# Altium project MainBoard.PrjPCB (part 1 of 2)
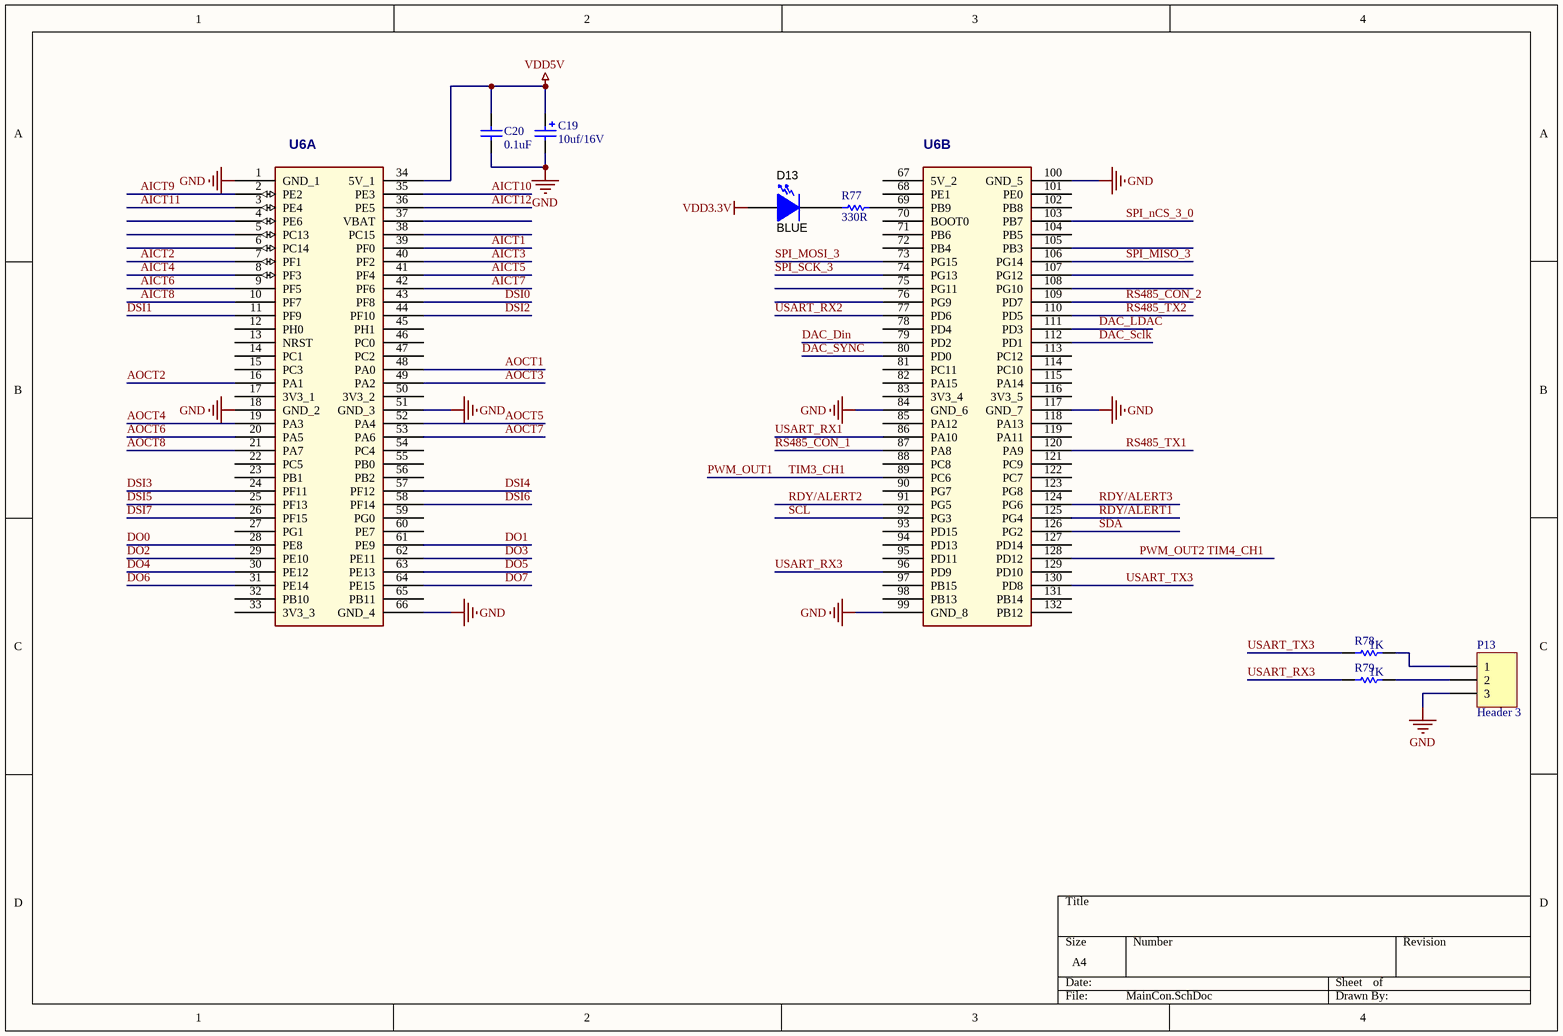
[diagram p0: MainCon.SchDoc]
9 sheets, 474 parts. Net scope: global (net labels, ports and power ports of the same name join across sheets).
Board file: MainBoard.PcbDoc
Sheets:
  MainCon.SchDoc
  MainPower.SchDoc
  MainDAC.SchDoc
  MainADC.SchDoc
  MainMux.SchDoc
  MainRTD.SchDoc
  Main485.SchDoc
  MainDin.SchDoc
  MainDout.SchDoc

## Sheet MainCon.SchDoc
size A4

### Parts
C19  value 10uf/16V  [Cap-A]
C20  value 0.1uF  [C0805]  (hidden comment: Cap)
D13  value BLUE  [D0805]  (hidden comment: SML-P12YTT86)
P13  Header 3  [HDR1X3]
R77  value 330R  [0805]  (hidden comment: Res Semi)
R78  value 1K  [0805]  (hidden comment: Res1)
R79  value 1K  [0805]  (hidden comment: Res1)
U6  STM32Z_MOD  [STM32VEMOD]  (value not drawn)  (parts A,B of 2)

### Nets
GND: C19.2 C20.1 P13.3 U6.1(GND_1) U6.18(GND_2) U6.51(GND_3) U6.66(GND_4) U6.84(GND_6) U6.99(GND_8) U6.100(GND_5) U6.117(GND_7)
VDD3.3V: D13.1(A)
VDD5V: C19.1 C20.2 U6.34(5V_1)
AICT1: U6.39(PF0)
AICT2: U6.7(PF1)
AICT3: U6.40(PF2)
AICT4: U6.8(PF3)
AICT5: U6.41(PF4)
AICT6: U6.9(PF5)
AICT7: U6.42(PF6)
AICT8: U6.10(PF7)
AICT9: U6.2(PE2)
AICT10: U6.35(PE3)
AICT11: U6.3(PE4)
AICT12: U6.36(PE5)
AOCT1: U6.48(PA0)
AOCT2: U6.16(PA1)
AOCT3: U6.49(PA2)
AOCT4: U6.19(PA3)
AOCT5: U6.52(PA4)
AOCT6: U6.20(PA5)
AOCT7: U6.53(PA6)
AOCT8: U6.21(PA7)
DAC_Din: U6.79(PD2)
DAC_LDAC: U6.111(PD3)
DAC_Sclk: U6.112(PD1)
DAC_SYNC: U6.80(PD0)
DO0: U6.28(PE8)
DO1: U6.61(PE9)
DO2: U6.29(PE10)
DO3: U6.62(PE11)
DO4: U6.30(PE12)
DO5: U6.63(PE13)
DO6: U6.31(PE14)
DO7: U6.64(PE15)
DSI0: U6.43(PF8)
DSI1: U6.11(PF9)
DSI2: U6.44(PF10)
DSI3: U6.24(PF11)
DSI4: U6.57(PF12)
DSI5: U6.25(PF13)
DSI6: U6.58(PF14)
DSI7: U6.26(PF15)
PWM_OUT1: U6.89(PC6)  [also labelled TIM3_CH1]
PWM_OUT2: U6.128(PD12)  [also labelled TIM4_CH1]
RDY/ALERT1: U6.125(PG4)
RDY/ALERT2: U6.91(PG5)
RDY/ALERT3: U6.124(PG6)
RS485_CON_1: U6.87(PA8)
RS485_CON_2: U6.109(PD7)
RS485_TX1: U6.120(PA9)
RS485_TX2: U6.110(PD5)
SCL: U6.92(PG3)
SDA: U6.126(PG2)
SPI_MISO_3: U6.106(PG14)
SPI_MOSI_3: U6.73(PG15)
SPI_nCS_3_0: U6.103(PB7)
SPI_SCK_3: U6.74(PG13)
USART_RX1: U6.86(PA10)
USART_RX2: U6.77(PD6)
USART_RX3: R79.1 U6.96(PD9)
USART_TX3: R78.1 U6.130(PD8)
NetD13_2: D13.2(K) R77.2
NetP13_1: P13.1 R78.2
NetP13_2: P13.2 R79.2
NetR77_1: R77.1 U6.69(PB9)

Not connected (* = marked no-connect by the designer): U6 4(PE6) 5(PC13) 6(PC14) 12(PH0) 13(NRST) 14(PC1) 15(PC3) 17(3V3_1) 22(PC5) 23(PB1) 27(PG1) 32(PB10) 33(3V3_3) 37(VBAT) 38(PC15) 45(PH1) 46(PC0) 47(PC2) 50(3V3_2) 54(PC4) 55(PB0) 56(PB2) 59(PG0) 60(PE7) 65(PB11) 67(5V_2) 68(PE1) 70(BOOT0) 71(PB6) 72(PB4) 75(PG11) 76(PG9) 78(PD4) 81(PC11) 82(PA15) 83(3V3_4) 85(PA12) 88(PC8) 90(PG7) 93(PD15) 94(PD13) 95(PD11) 97(PB15) 98(PB13) 101(PE0) 102(PB8) 104(PB5) 105(PB3) 107(PG12) 108(PG10) 113(PC12) 114(PC10) 115(PA14) 116(3V3_5) 118(PA13) 119(PA11) 121(PC9) 122(PC7) 123(PG8) 127(PD14) 129(PD10) 131(PB14) 132(PB12)

### Library data of the parts
C19 = Cap Pol2: Polarized Capacitor (Axial); Published: 8-Jun-2000; LatestRevisionDate: 17-Jul-2002; LatestRevisionNote: Re-released for DXP Platform.; PackageReference: POLAR0.8; Publisher: Altium Limited; PackageDescription: Polarized Capacitor; 2 Leads
C20 = Cap_2: Capacitor; Published: 8-Jun-2000; LatestRevisionDate: 17-Jul-2002; LatestRevisionNote: Re-released for DXP Platform.; Publisher: Altium Limited
D13 = SML-P12YTT86: LED, GREEN SMD; Manufacturer: Rohm; Type: InGaN; Vf_V: 2.1; Value2: 2.1V; Io_A: 0.02; Tjmax_C: 85; Value1: W; Color: yellow; U/M: EA; CompType: LED; PartNumber: SML-P12YTT86; SymbolVersion: 2008-12-08; MountType: SMT; RoHS: Y; PackageReference: Yellow LED; Published: 2008-07-11; Publisher: Texas Instruments; ComponentLink1URL: http://rohmfs.rohm.com/en/products/databook/datasheet/opto/led/chip_mono/sml-p1.pdf; ComponentLink1Description: Datasheet link; LatestRevisionDate: 2013-06-24; LatestRevisionNote: Updated supplier queries; Supplier 1: Digi-Key; Supplier Part Number 1: 511-1595-1-ND; Supplier 2: Mouser; Supplier Part Number 2: 755-SML-P12YTT86; Supplier 3: Farnell; Supplier Part Number 3: 1973107
P13 = Header 3: Header, 3-Pin; LatestRevisionDate: 17-Jul-2002; LatestRevisionNote: Re-released for DXP Platform.; Publisher: Altium Limited
R77 = Res Semi: Semiconductor Resistor; Published: 8-Jun-2000; LatestRevisionDate: 17-Jul-2002; LatestRevisionNote: Re-released for DXP Platform.; PackageReference: AXIAL-0.5; Publisher: Altium Limited
R78 R79 = Res1: Resistor; Published: 8-Jun-2000; LatestRevisionDate: 17-Jul-2002; LatestRevisionNote: Re-released for DXP Platform.; PackageReference: AXIAL-0.3; Publisher: Altium Limited
U6 = STM32Z_MOD: PCB Footprint SMD: 插件; TOLERANCE: =U5_TOLERANCE; Technology: 2mm，2X33插座

## Sheet MainPower.SchDoc
size A4
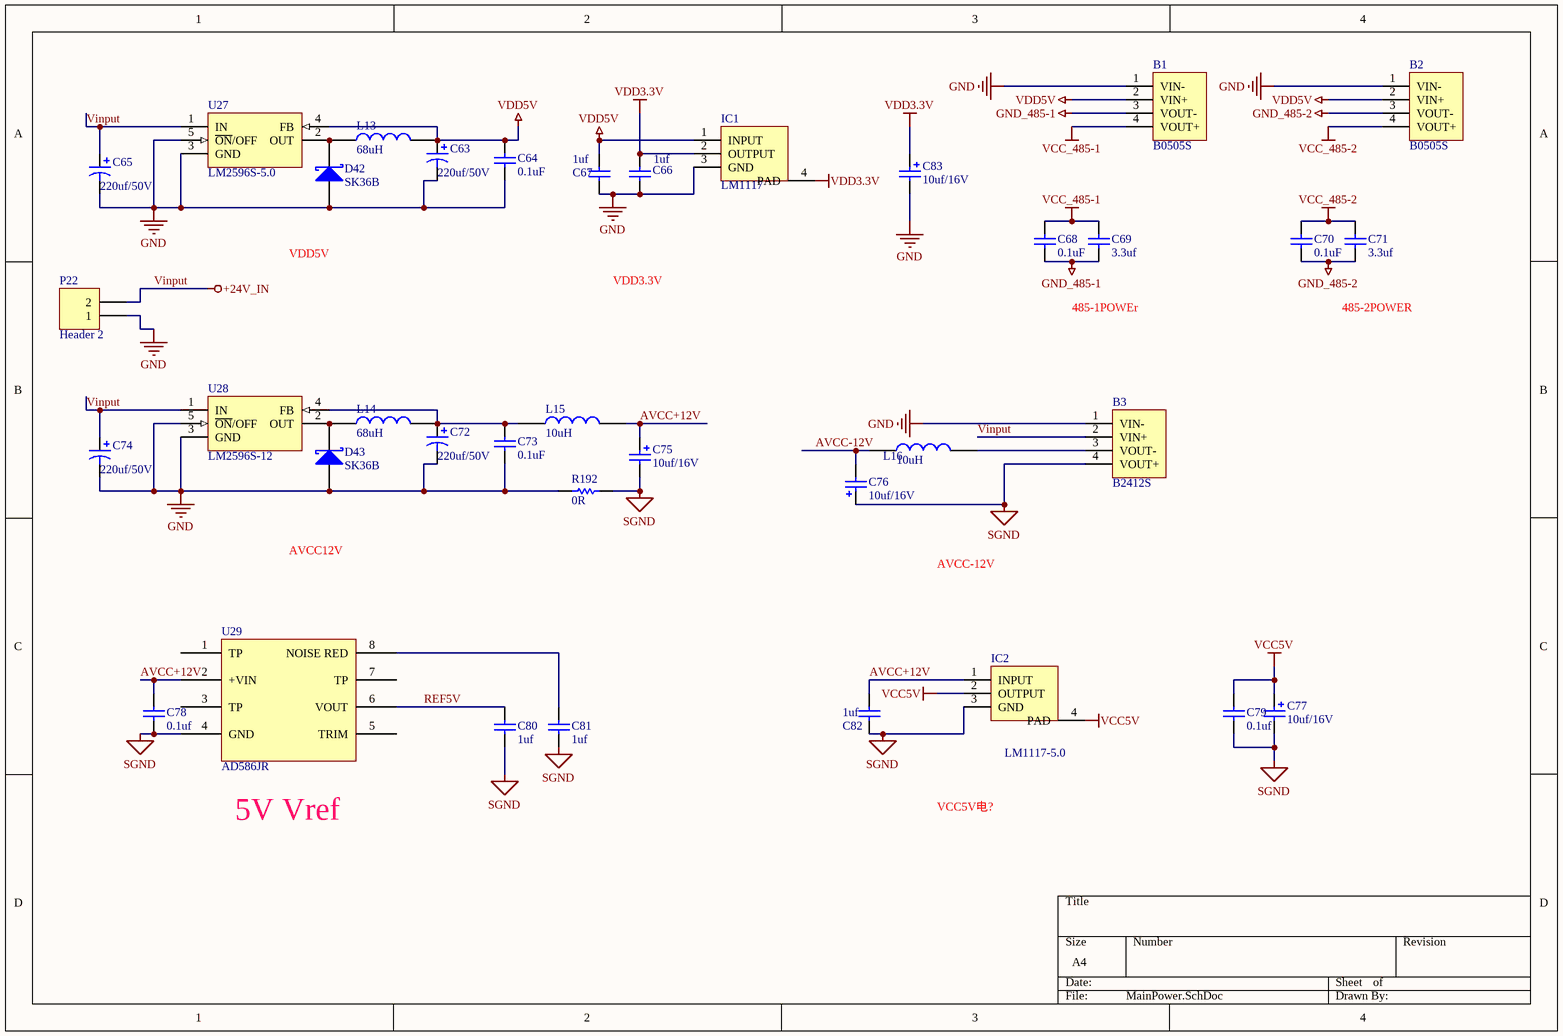
[diagram p1: MainPower.SchDoc]

### Parts
B1  B0505S  [B0505S]
B2  B0505S  [B0505S]
B3  B2412S  [B0505S]
C63  value 220uf/50V  [Cap5*10*12]  (hidden comment: Cap Pol1)
C64  value 0.1uF  [C0805]  (hidden comment: Cap)
C65  value 220uf/50V  [Cap5*10*12]  (hidden comment: Cap Pol1)
C66  value 1uf  [C0805]  (hidden comment: Cap)
C67  value 1uf  [C0805]  (hidden comment: Cap)
C68  value 0.1uF  [C0805]  (hidden comment: Cap)
C69  value 3.3uf  [C0805]  (hidden comment: Cap)
C70  value 0.1uF  [C0805]  (hidden comment: Cap)
C71  value 3.3uf  [C0805]  (hidden comment: Cap)
C72  value 220uf/50V  [Cap5*10*12]  (hidden comment: Cap Pol1)
C73  value 0.1uF  [C0805]  (hidden comment: Cap)
C74  value 220uf/50V  [Cap5*10*12]  (hidden comment: Cap Pol1)
C75  value 10uf/16V  [Cap-A]
C76  value 10uf/16V  [Cap-A]
C77  value 10uf/16V  [Cap-A]
C78  value 0.1uf  [C0805]  (hidden comment: Cap)
C79  value 0.1uf  [C0805]  (hidden comment: Cap)
C80  value 1uf  [C0805]  (hidden comment: Cap)
C81  value 1uf  [C0805]  (hidden comment: Cap)
C82  value 1uf  [C0805]  (hidden comment: Cap)
C83  value 10uf/16V  [Cap-A]
D42  SK36B  [SMB]
D43  SK36B  [SMB]
IC1  LM1117  [LM1117]
IC2  LM1117-5.0  [LM1117]
L13  68uH  [IND_HM00_12*12]
L14  68uH  [IND_HM00_12*12]
L15  10uH  [L1206]
L16  10uH  [L1206]
P22  Header 2  [JIEKE_2PX508]
R192  value 0R  [0805]  (hidden comment: Res Semi)
U27  LM2596S-5.0  [TS5B_M]
U28  LM2596S-12  [TS5B_M]
U29  AD586JR  [SOP8_M]

### Nets
GND: B1.1(VIN-) B2.1(VIN-) B3.1(VIN-) C63.2 C64.1 C65.2 C66.2 C67.2 C72.2 C73.1 C74.2 C83.2 D42.1(A) D43.1(A) IC1.3(GND) P22.1 R192.2 U27.3(GND) U27.5(~{ON}/OFF) U28.3(GND) U28.5(~{ON}/OFF)
GND_485-1: B1.3(VOUT-) C68.1 C69.1
GND_485-2: B2.3(VOUT-) C70.1 C71.1
SGND: B3.4(VOUT+) C75.2 C76.1 C77.2 C78.2 C79.2 C80.2 C81.2 C82.2 IC2.3(GND) R192.1 U29.4(GND)
VCC5V: C77.1 C79.1 IC2.2(OUTPUT) IC2.4(PAD)
VCC_485-1: B1.4(VOUT+) C68.2 C69.2
VCC_485-2: B2.4(VOUT+) C70.2 C71.2
VDD3.3V: C66.1 C83.1 IC1.2(OUTPUT) IC1.4(PAD)
VDD5V: B1.2(VIN+) B2.2(VIN+) C63.1 C64.2 C67.1 IC1.1(INPUT) L13.2 U27.4(FB)
Vinput: B3.2(VIN+) C65.1 C74.1 P22.2 U27.1(IN) U28.1(IN)  [also labelled +24V_IN]
AVCC+12V: C75.1 C78.1 C82.1 IC2.1(INPUT) L15.2 U29.2(+VIN)
AVCC-12V: C76.2 L16.1
REF5V: C80.1 U29.6(VOUT)
NetB3_3: B3.3(VOUT-) L16.2
NetC72_1: C72.1 C73.2 L14.2 L15.1 U28.4(FB)
NetC81_1: C81.1 U29.8(NOISE_RED)
NetD42_2: D42.2(K) L13.1 U27.2(OUT)
NetD43_2: D43.2(K) L14.1 U28.2(OUT)

Not connected (* = marked no-connect by the designer): U29 1(TP) 3(TP) 5(TRIM) 7(TP)

### Notes on the sheet
- VDD5V
- VDD3.3V
- 485-1POWEr
- 485-2POWER
- AVCC12V
- AVCC-12V
- 5V Vref
- VCC5V电?

### Library data of the parts
B3 = B0505S
C63 C65 C72 C74 = Cap Pol1: Polarized Capacitor (Radial); Published: 8-Jun-2000; LatestRevisionDate: 17-Jul-2002; LatestRevisionNote: Re-released for DXP Platform.; PackageReference: RB7.6-15; Publisher: Altium Limited
C64 C68-C71 C73 = Cap_2: Capacitor; Published: 8-Jun-2000; LatestRevisionDate: 17-Jul-2002; LatestRevisionNote: Re-released for DXP Platform.; Publisher: Altium Limited
C66 C67 C78-C82 = Cap: Capacitor; Manufacturer: Generic Components; Class: Passive; Published: 08/06/2000; Publisher: Altium Hobart Technology Centre; SubClass: Capacitor
C75-C77 C83 = Cap Pol2: Polarized Capacitor (Axial); Published: 8-Jun-2000; LatestRevisionDate: 17-Jul-2002; LatestRevisionNote: Re-released for DXP Platform.; PackageReference: POLAR0.8; Publisher: Altium Limited; PackageDescription: Polarized Capacitor; 2 Leads
D42 D43 = D Schottky: Schottky Diode; Published: 8-Jun-2000; LatestRevisionDate: 17-Jul-2002; LatestRevisionNote: Re-released for DXP Platform.; PackageReference: SMB; Publisher: Altium Limited; Code_JEDEC: DO-214-AA
IC2 = LM1117
L13-L16 = INDUCTOR
P22 = Header 2: Header, 2-Pin; LatestRevisionDate: 17-Jul-2002; LatestRevisionNote: Re-released for DXP Platform.; Publisher: Altium Limited
R192 = Res Semi: Semiconductor Resistor; Published: 8-Jun-2000; LatestRevisionDate: 17-Jul-2002; LatestRevisionNote: Re-released for DXP Platform.; PackageReference: AXIAL-0.5; Publisher: Altium Limited
U27 = LM2596S-5.0: Simple Switcher Power Converter 150 kHz 3A Step Down Voltage Regulator; Note: Tab is connected to GND; Published: 15-Apr-2002; DatasheetVersion: Dec-1997; PackageReference: TS5B; Publisher: Altium Limited; PackageDescription: D2-PAK; 5 Leads; Body 14.4 (inc. leads) x 10.4 mm (LxW max); ComponentLink1Description: Manufacturer Link; ComponentLink1URL: http://www.national.com/; ComponentLink2Description: Datasheet; ComponentLink2URL: http://www.national.com/ds.cgi/LM/LM2596.pdf; ComponentLink3Description: URL Link1; ComponentLink3URL: http://www.national.com/pf/LM/LM2596.html
U28 = LM2596S-12: Simple Switcher Power Converter 150 kHz 3A Step Down Voltage Regulator; Note: Tab is connected to GND; Published: 15-Apr-2002; DatasheetVersion: Dec-1997; PackageReference: TS5B; Publisher: Altium Limited; PackageDescription: D2-PAK; 5 Leads; Body 14.4 (inc. leads) x 10.4 mm (LxW max); ComponentLink1Description: Manufacturer Link; ComponentLink1URL: http://www.national.com/; ComponentLink2Description: Datasheet; ComponentLink2URL: http://www.national.com/ds.cgi/LM/LM2596.pdf; ComponentLink3Description: URL Link1; ComponentLink3URL: http://www.national.com/pf/LM/LM2596.html
U29 = AD586L

## Sheet MainDAC.SchDoc
size A2
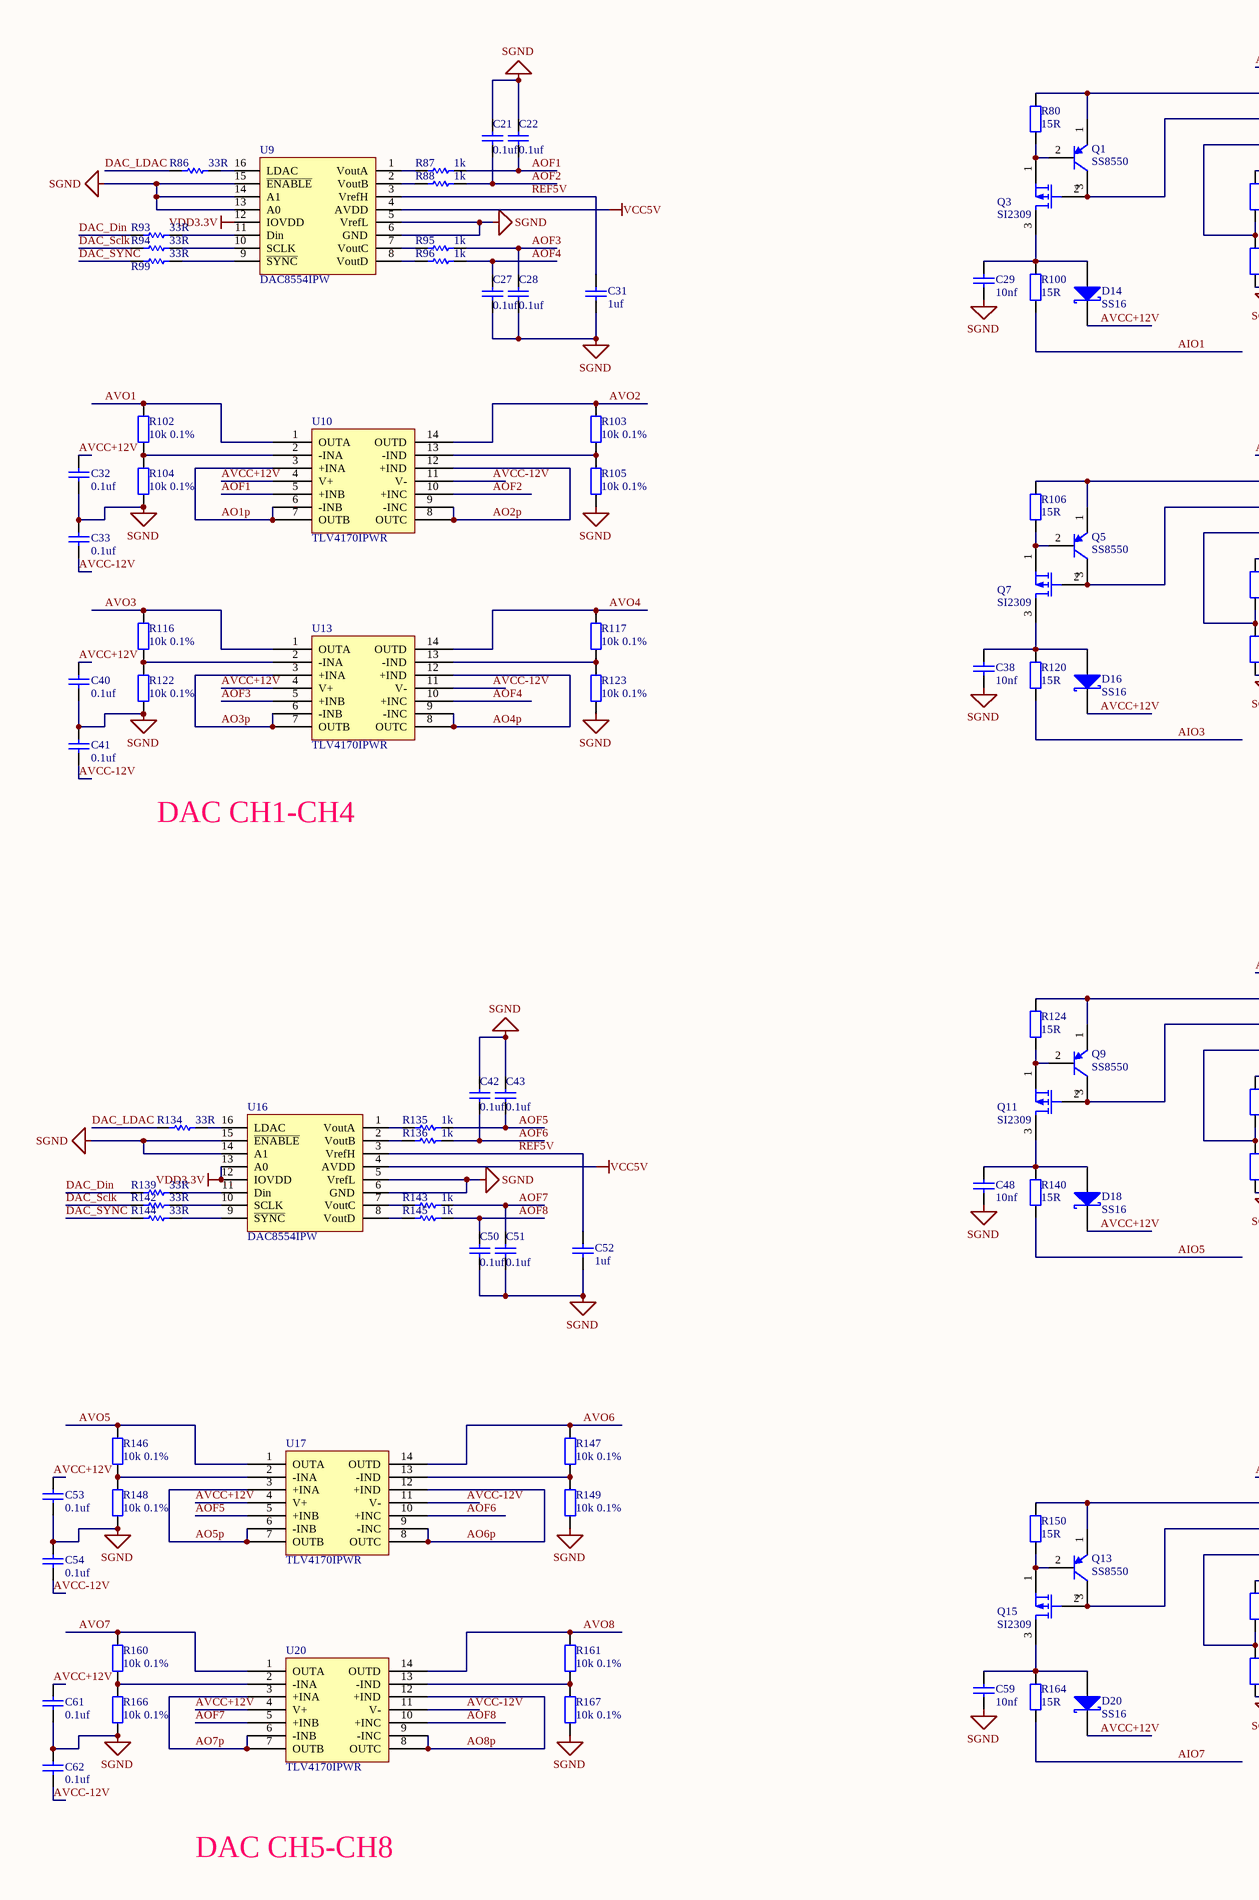
[diagram p2: MainDAC.SchDoc, left]
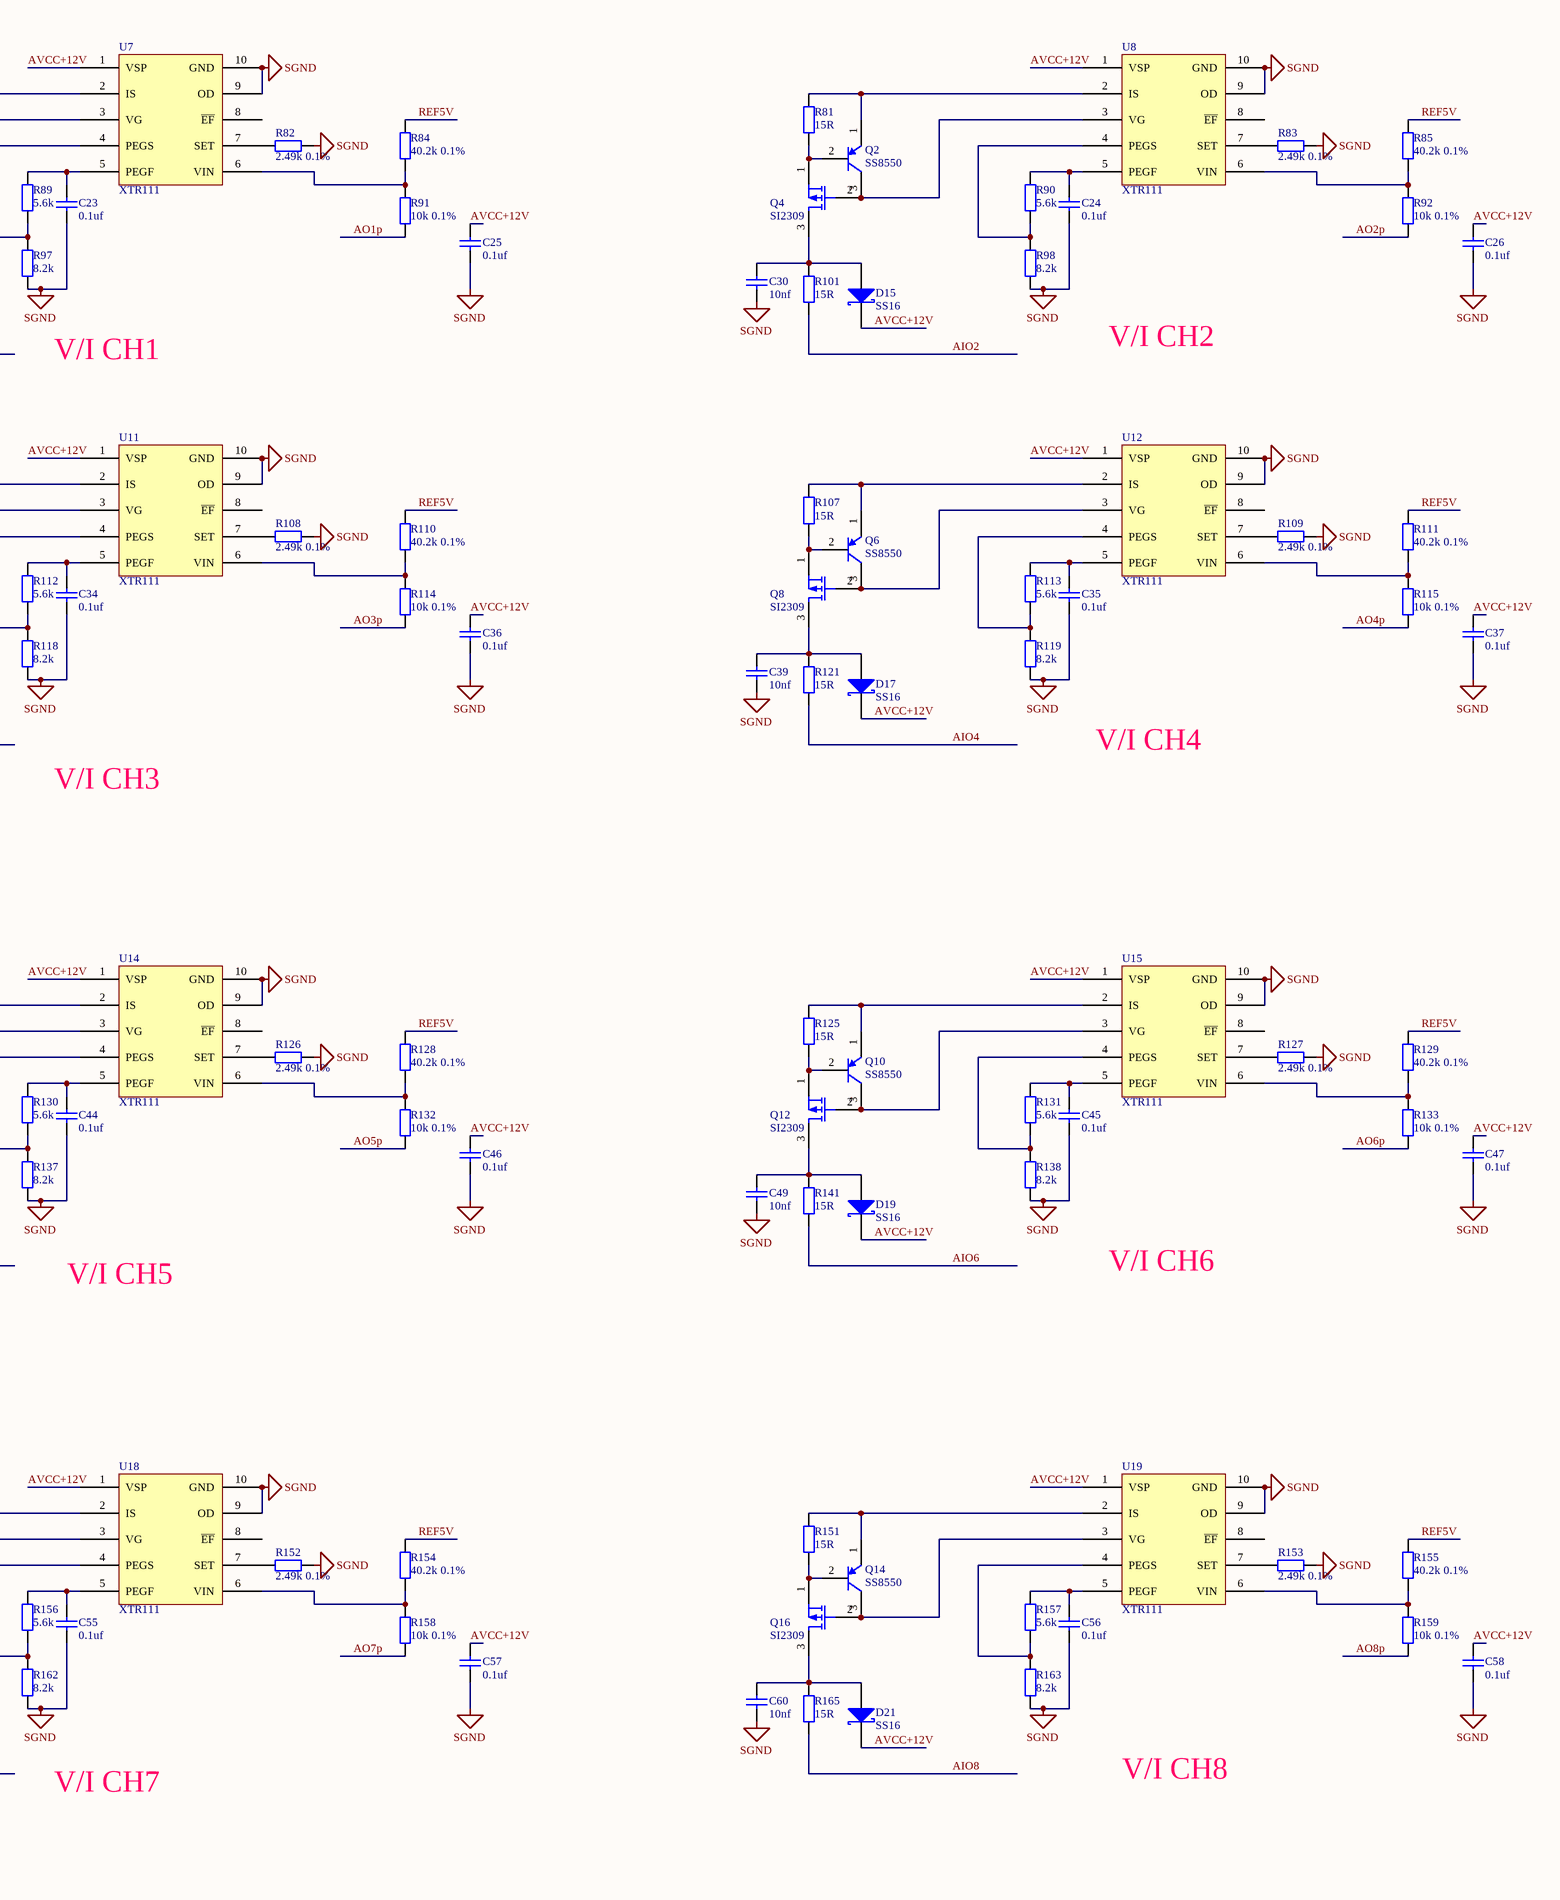
[diagram p3: MainDAC.SchDoc, right]

### Parts
C21  value 0.1uf  [C0805]  (hidden comment: Cap)
C22  value 0.1uf  [C0805]  (hidden comment: Cap)
C23  value 0.1uf  [C0805]  (hidden comment: Cap)
C24  value 0.1uf  [C0805]  (hidden comment: Cap)
C25  value 0.1uf  [C0805]  (hidden comment: Cap)
C26  value 0.1uf  [C0805]  (hidden comment: Cap)
C27  value 0.1uf  [C0805]  (hidden comment: Cap)
C28  value 0.1uf  [C0805]  (hidden comment: Cap)
C29  value 10nf  [C0805]  (hidden comment: Cap)
C30  value 10nf  [C0805]  (hidden comment: Cap)
C31  value 1uf  [C0805]  (hidden comment: Cap)
C32  value 0.1uf  [C0805]  (hidden comment: Cap)
C33  value 0.1uf  [C0805]  (hidden comment: Cap)
C34  value 0.1uf  [C0805]  (hidden comment: Cap)
C35  value 0.1uf  [C0805]  (hidden comment: Cap)
C36  value 0.1uf  [C0805]  (hidden comment: Cap)
C37  value 0.1uf  [C0805]  (hidden comment: Cap)
C38  value 10nf  [C0805]  (hidden comment: Cap)
C39  value 10nf  [C0805]  (hidden comment: Cap)
C40  value 0.1uf  [C0805]  (hidden comment: Cap)
C41  value 0.1uf  [C0805]  (hidden comment: Cap)
C42  value 0.1uf  [C0805]  (hidden comment: Cap)
C43  value 0.1uf  [C0805]  (hidden comment: Cap)
C44  value 0.1uf  [C0805]  (hidden comment: Cap)
C45  value 0.1uf  [C0805]  (hidden comment: Cap)
C46  value 0.1uf  [C0805]  (hidden comment: Cap)
C47  value 0.1uf  [C0805]  (hidden comment: Cap)
C48  value 10nf  [C0805]  (hidden comment: Cap)
C49  value 10nf  [C0805]  (hidden comment: Cap)
C50  value 0.1uf  [C0805]  (hidden comment: Cap)
C51  value 0.1uf  [C0805]  (hidden comment: Cap)
C52  value 1uf  [C0805]  (hidden comment: Cap)
C53  value 0.1uf  [C0805]  (hidden comment: Cap)
C54  value 0.1uf  [C0805]  (hidden comment: Cap)
C55  value 0.1uf  [C0805]  (hidden comment: Cap)
C56  value 0.1uf  [C0805]  (hidden comment: Cap)
C57  value 0.1uf  [C0805]  (hidden comment: Cap)
C58  value 0.1uf  [C0805]  (hidden comment: Cap)
C59  value 10nf  [C0805]  (hidden comment: Cap)
C60  value 10nf  [C0805]  (hidden comment: Cap)
C61  value 0.1uf  [C0805]  (hidden comment: Cap)
C62  value 0.1uf  [C0805]  (hidden comment: Cap)
D14  SS16  [SMB]
D15  SS16  [SMB]
D16  SS16  [SMB]
D17  SS16  [SMB]
D18  SS16  [SMB]
D19  SS16  [SMB]
D20  SS16  [SMB]
D21  SS16  [SMB]
Q1  SS8550  [sot-23]
Q2  SS8550  [sot-23]
Q3  SI2309  [sot-23]
Q4  SI2309  [sot-23]
Q5  SS8550  [sot-23]
Q6  SS8550  [sot-23]
Q7  SI2309  [sot-23]
Q8  SI2309  [sot-23]
Q9  SS8550  [sot-23]
Q10  SS8550  [sot-23]
Q11  SI2309  [sot-23]
Q12  SI2309  [sot-23]
Q13  SS8550  [sot-23]
Q14  SS8550  [sot-23]
Q15  SI2309  [sot-23]
Q16  SI2309  [sot-23]
R80  value 15R  [0805]  (hidden comment: Res2)
R81  value 15R  [0805]  (hidden comment: Res2)
R82  value 2.49k 0.1%  [0805]  (hidden comment: Res2)
R83  value 2.49k 0.1%  [0805]  (hidden comment: Res2)
R84  value 40.2k 0.1%  [0805]  (hidden comment: Res2)
R85  value 40.2k 0.1%  [0805]  (hidden comment: Res2)
R86  value 33R  [0805]  (hidden comment: Res Semi)
R87  value 1k  [0805]  (hidden comment: Res Semi)
R88  value 1k  [0805]  (hidden comment: Res Semi)
R89  value 5.6k  [0805]  (hidden comment: Res2)
R90  value 5.6k  [0805]  (hidden comment: Res2)
R91  value 10k 0.1%  [0805]  (hidden comment: Res2)
R92  value 10k 0.1%  [0805]  (hidden comment: Res2)
R93  value 33R  [0805]  (hidden comment: Res Semi)
R94  value 33R  [0805]  (hidden comment: Res Semi)
R95  value 1k  [0805]  (hidden comment: Res Semi)
R96  value 1k  [0805]  (hidden comment: Res Semi)
R97  value 8.2k  [0805]  (hidden comment: Res2)
R98  value 8.2k  [0805]  (hidden comment: Res2)
R99  value 33R  [0805]  (hidden comment: Res Semi)
R100  value 15R  [0805]  (hidden comment: Res2)
R101  value 15R  [0805]  (hidden comment: Res2)
R102  value 10k 0.1%  [0805]  (hidden comment: Res2)
R103  value 10k 0.1%  [0805]  (hidden comment: Res2)
R104  value 10k 0.1%  [0805]  (hidden comment: Res2)
R105  value 10k 0.1%  [0805]  (hidden comment: Res2)
R106  value 15R  [0805]  (hidden comment: Res2)
R107  value 15R  [0805]  (hidden comment: Res2)
R108  value 2.49k 0.1%  [0805]  (hidden comment: Res2)
R109  value 2.49k 0.1%  [0805]  (hidden comment: Res2)
R110  value 40.2k 0.1%  [0805]  (hidden comment: Res2)
R111  value 40.2k 0.1%  [0805]  (hidden comment: Res2)
R112  value 5.6k  [0805]  (hidden comment: Res2)
R113  value 5.6k  [0805]  (hidden comment: Res2)
R114  value 10k 0.1%  [0805]  (hidden comment: Res2)
R115  value 10k 0.1%  [0805]  (hidden comment: Res2)
R116  value 10k 0.1%  [0805]  (hidden comment: Res2)
R117  value 10k 0.1%  [0805]  (hidden comment: Res2)
R118  value 8.2k  [0805]  (hidden comment: Res2)
R119  value 8.2k  [0805]  (hidden comment: Res2)
R120  value 15R  [0805]  (hidden comment: Res2)
R121  value 15R  [0805]  (hidden comment: Res2)
R122  value 10k 0.1%  [0805]  (hidden comment: Res2)
R123  value 10k 0.1%  [0805]  (hidden comment: Res2)
R124  value 15R  [0805]  (hidden comment: Res2)
R125  value 15R  [0805]  (hidden comment: Res2)
R126  value 2.49k 0.1%  [0805]  (hidden comment: Res2)
R127  value 2.49k 0.1%  [0805]  (hidden comment: Res2)
R128  value 40.2k 0.1%  [0805]  (hidden comment: Res2)
R129  value 40.2k 0.1%  [0805]  (hidden comment: Res2)
R130  value 5.6k  [0805]  (hidden comment: Res2)
R131  value 5.6k  [0805]  (hidden comment: Res2)
R132  value 10k 0.1%  [0805]  (hidden comment: Res2)
R133  value 10k 0.1%  [0805]  (hidden comment: Res2)
R134  value 33R  [0805]  (hidden comment: Res Semi)
R135  value 1k  [0805]  (hidden comment: Res Semi)
R136  value 1k  [0805]  (hidden comment: Res Semi)
R137  value 8.2k  [0805]  (hidden comment: Res2)
R138  value 8.2k  [0805]  (hidden comment: Res2)
R139  value 33R  [0805]  (hidden comment: Res Semi)
R140  value 15R  [0805]  (hidden comment: Res2)
R141  value 15R  [0805]  (hidden comment: Res2)
R142  value 33R  [0805]  (hidden comment: Res Semi)
R143  value 1k  [0805]  (hidden comment: Res Semi)
R144  value 33R  [0805]  (hidden comment: Res Semi)
R145  value 1k  [0805]  (hidden comment: Res Semi)
R146  value 10k 0.1%  [0805]  (hidden comment: Res2)
R147  value 10k 0.1%  [0805]  (hidden comment: Res2)
R148  value 10k 0.1%  [0805]  (hidden comment: Res2)
R149  value 10k 0.1%  [0805]  (hidden comment: Res2)
R150  value 15R  [0805]  (hidden comment: Res2)
R151  value 15R  [0805]  (hidden comment: Res2)
R152  value 2.49k 0.1%  [0805]  (hidden comment: Res2)
R153  value 2.49k 0.1%  [0805]  (hidden comment: Res2)
R154  value 40.2k 0.1%  [0805]  (hidden comment: Res2)
R155  value 40.2k 0.1%  [0805]  (hidden comment: Res2)
R156  value 5.6k  [0805]  (hidden comment: Res2)
R157  value 5.6k  [0805]  (hidden comment: Res2)
R158  value 10k 0.1%  [0805]  (hidden comment: Res2)
R159  value 10k 0.1%  [0805]  (hidden comment: Res2)
R160  value 10k 0.1%  [0805]  (hidden comment: Res2)
R161  value 10k 0.1%  [0805]  (hidden comment: Res2)
R162  value 8.2k  [0805]  (hidden comment: Res2)
R163  value 8.2k  [0805]  (hidden comment: Res2)
R164  value 15R  [0805]  (hidden comment: Res2)
R165  value 15R  [0805]  (hidden comment: Res2)
R166  value 10k 0.1%  [0805]  (hidden comment: Res2)
R167  value 10k 0.1%  [0805]  (hidden comment: Res2)
U7  XTR111  [TSSOP-10_P]
U8  XTR111  [TSSOP-10_P]
U9  DAC8554IPW  [TSSOP16]
U10  TLV4170IPWR  [WSOP14*0.65]
U11  XTR111  [TSSOP-10_P]
U12  XTR111  [TSSOP-10_P]
U13  TLV4170IPWR  [WSOP14*0.65]
U14  XTR111  [TSSOP-10_P]
U15  XTR111  [TSSOP-10_P]
U16  DAC8554IPW  [TSSOP16]
U17  TLV4170IPWR  [WSOP14*0.65]
U18  XTR111  [TSSOP-10_P]
U19  XTR111  [TSSOP-10_P]
U20  TLV4170IPWR  [WSOP14*0.65]

### Nets
SGND: C21.1 C22.1 C23.2 C24.2 C25.2 C26.2 C27.2 C28.2 C29.2 C30.2 C31.1 C32.2 C33.1 C34.2 C35.2 C36.2 C37.2 C38.2 C39.2 C40.2 C41.1 C42.1 C43.1 C44.2 C45.2 C46.2 C47.2 C48.2 C49.2 C50.2 C51.2 C52.1 C53.2 C54.1 C55.2 C56.2 C57.2 C58.2 C59.2 C60.2 C61.2 C62.1 R82.2 R83.2 R97.2 R98.2 R104.2 R105.2 R108.2 R109.2 R118.2 R119.2 R122.2 R123.2 R126.2 R127.2 R137.2 R138.2 R148.2 R149.2 R152.2 R153.2 R162.2 R163.2 R166.2 R167.2 U7.9(OD) U7.10(GND) U8.9(OD) U8.10(GND) U9.5(VrefL) U9.6(GND) U9.13(A0) U9.14(A1) U9.15(~{ENABLE}) U11.9(OD) U11.10(GND) U12.9(OD) U12.10(GND) U14.9(OD) U14.10(GND) U15.9(OD) U15.10(GND) U16.5(VrefL) U16.6(GND) U16.14(A1) U16.15(~{ENABLE}) U18.9(OD) U18.10(GND) U19.9(OD) U19.10(GND)
VCC5V: U9.4(AVDD) U16.4(AVDD)
VDD3.3V: U9.12(IOVDD) U16.12(IOVDD) U16.13(A0)
AIO1: R100.2
AIO2: R101.2
AIO3: R120.2
AIO4: R121.2
AIO5: R140.2
AIO6: R141.2
AIO7: R164.2
AIO8: R165.2
AO1p: R91.2 U10.3(+INA) U10.6(-INB) U10.7(OUTB)
AO2p: R92.2 U10.8(OUTC) U10.9(-INC) U10.12(+IND)
AO3p: R114.2 U13.3(+INA) U13.6(-INB) U13.7(OUTB)
AO4p: R115.2 U13.8(OUTC) U13.9(-INC) U13.12(+IND)
AO5p: R132.2 U17.3(+INA) U17.6(-INB) U17.7(OUTB)
AO6p: R133.2 U17.8(OUTC) U17.9(-INC) U17.12(+IND)
AO7p: R158.2 U20.3(+INA) U20.6(-INB) U20.7(OUTB)
AO8p: R159.2 U20.8(OUTC) U20.9(-INC) U20.12(+IND)
AOF1: C22.2 R87.1 U10.5(+INB)
AOF2: C21.2 R88.1 U10.10(+INC)
AOF3: C28.1 R95.1 U13.5(+INB)
AOF4: C27.1 R96.1 U13.10(+INC)
AOF5: C43.2 R135.1 U17.5(+INB)
AOF6: C42.2 R136.1 U17.10(+INC)
AOF7: C51.1 R143.1 U20.5(+INB)
AOF8: C50.1 R145.1 U20.10(+INC)
AVCC+12V: C25.1 C26.1 C32.1 C36.1 C37.1 C40.1 C46.1 C47.1 C53.1 C57.1 C58.1 C61.1 D14.2(K) D15.2(K) D16.2(K) D17.2(K) D18.2(K) D19.2(K) D20.2(K) D21.2(K) U7.1(VSP) U8.1(VSP) U10.4(V+) U11.1(VSP) U12.1(VSP) U13.4(V+) U14.1(VSP) U15.1(VSP) U17.4(V+) U18.1(VSP) U19.1(VSP) U20.4(V+)
AVCC-12V: C33.2 C41.2 C54.2 C62.2 U10.11(V-) U13.11(V-) U17.11(V-) U20.11(V-)
AVO1: R102.1 U10.1(OUTA)
AVO2: R103.1 U10.14(OUTD)
AVO3: R116.1 U13.1(OUTA)
AVO4: R117.1 U13.14(OUTD)
AVO5: R146.1 U17.1(OUTA)
AVO6: R147.1 U17.14(OUTD)
AVO7: R160.1 U20.1(OUTA)
AVO8: R161.1 U20.14(OUTD)
DAC_Din: R93.2 R139.2
DAC_LDAC: R86.2 R134.2
DAC_Sclk: R94.2 R142.2
DAC_SYNC: R99.2 R144.2
REF5V: C31.2 C52.2 R84.1 R85.1 R110.1 R111.1 R128.1 R129.1 R154.1 R155.1 U9.3(VrefH) U16.3(VrefH)
NetC23_1: C23.1 R89.1 U7.5(PEGF)
NetC24_1: C24.1 R90.1 U8.5(PEGF)
NetC29_1: C29.1 D14.1(A) Q3.3(D) R100.1
NetC30_1: C30.1 D15.1(A) Q4.3(D) R101.1
NetC34_1: C34.1 R112.1 U11.5(PEGF)
NetC35_1: C35.1 R113.1 U12.5(PEGF)
NetC38_1: C38.1 D16.1(A) Q7.3(D) R120.1
NetC39_1: C39.1 D17.1(A) Q8.3(D) R121.1
NetC44_1: C44.1 R130.1 U14.5(PEGF)
NetC45_1: C45.1 R131.1 U15.5(PEGF)
NetC48_1: C48.1 D18.1(A) Q11.3(D) R140.1
NetC49_1: C49.1 D19.1(A) Q12.3(D) R141.1
NetC55_1: C55.1 R156.1 U18.5(PEGF)
NetC56_1: C56.1 R157.1 U19.5(PEGF)
NetC59_1: C59.1 D20.1(A) Q15.3(D) R164.1
NetC60_1: C60.1 D21.1(A) Q16.3(D) R165.1
NetQ1_1: Q1.1(E) R80.1 U7.2(IS)
NetQ1_2: Q1.2(B) Q3.1(S) R80.2
NetQ1_3: Q1.3(C) Q3.2(G) U7.3(VG)
NetQ2_1: Q2.1(E) R81.1 U8.2(IS)
NetQ2_2: Q2.2(B) Q4.1(S) R81.2
NetQ2_3: Q2.3(C) Q4.2(G) U8.3(VG)
NetQ5_1: Q5.1(E) R106.1 U11.2(IS)
NetQ5_2: Q5.2(B) Q7.1(S) R106.2
NetQ5_3: Q5.3(C) Q7.2(G) U11.3(VG)
NetQ6_1: Q6.1(E) R107.1 U12.2(IS)
NetQ6_2: Q6.2(B) Q8.1(S) R107.2
NetQ6_3: Q6.3(C) Q8.2(G) U12.3(VG)
NetQ9_1: Q9.1(E) R124.1 U14.2(IS)
NetQ9_2: Q9.2(B) Q11.1(S) R124.2
NetQ9_3: Q9.3(C) Q11.2(G) U14.3(VG)
NetQ10_1: Q10.1(E) R125.1 U15.2(IS)
NetQ10_2: Q10.2(B) Q12.1(S) R125.2
NetQ10_3: Q10.3(C) Q12.2(G) U15.3(VG)
NetQ13_1: Q13.1(E) R150.1 U18.2(IS)
NetQ13_2: Q13.2(B) Q15.1(S) R150.2
NetQ13_3: Q13.3(C) Q15.2(G) U18.3(VG)
NetQ14_1: Q14.1(E) R151.1 U19.2(IS)
NetQ14_2: Q14.2(B) Q16.1(S) R151.2
NetQ14_3: Q14.3(C) Q16.2(G) U19.3(VG)
NetR82_1: R82.1 U7.7(SET)
NetR83_1: R83.1 U8.7(SET)
NetR84_2: R84.2 R91.1 U7.6(VIN)
NetR85_2: R85.2 R92.1 U8.6(VIN)
NetR86_1: R86.1 U9.16(LDAC)
NetR87_2: R87.2 U9.1(VoutA)
NetR88_2: R88.2 U9.2(VoutB)
NetR89_2: R89.2 R97.1 U7.4(PEGS)
NetR90_2: R90.2 R98.1 U8.4(PEGS)
NetR93_1: R93.1 U9.11(Din)
NetR94_1: R94.1 U9.10(SCLK)
NetR95_2: R95.2 U9.7(VoutC)
NetR96_2: R96.2 U9.8(VoutD)
NetR99_1: R99.1 U9.9(~{SYNC})
NetR102_2: R102.2 R104.1 U10.2(-INA)
NetR103_2: R103.2 R105.1 U10.13(-IND)
NetR108_1: R108.1 U11.7(SET)
NetR109_1: R109.1 U12.7(SET)
NetR110_2: R110.2 R114.1 U11.6(VIN)
NetR111_2: R111.2 R115.1 U12.6(VIN)
NetR112_2: R112.2 R118.1 U11.4(PEGS)
NetR113_2: R113.2 R119.1 U12.4(PEGS)
NetR116_2: R116.2 R122.1 U13.2(-INA)
NetR117_2: R117.2 R123.1 U13.13(-IND)
NetR126_1: R126.1 U14.7(SET)
NetR127_1: R127.1 U15.7(SET)
NetR128_2: R128.2 R132.1 U14.6(VIN)
NetR129_2: R129.2 R133.1 U15.6(VIN)
NetR130_2: R130.2 R137.1 U14.4(PEGS)
NetR131_2: R131.2 R138.1 U15.4(PEGS)
NetR134_1: R134.1 U16.16(LDAC)
NetR135_2: R135.2 U16.1(VoutA)
NetR136_2: R136.2 U16.2(VoutB)
NetR139_1: R139.1 U16.11(Din)
NetR142_1: R142.1 U16.10(SCLK)
NetR143_2: R143.2 U16.7(VoutC)
NetR144_1: R144.1 U16.9(~{SYNC})
NetR145_2: R145.2 U16.8(VoutD)
NetR146_2: R146.2 R148.1 U17.2(-INA)
NetR147_2: R147.2 R149.1 U17.13(-IND)
NetR152_1: R152.1 U18.7(SET)
NetR153_1: R153.1 U19.7(SET)
NetR154_2: R154.2 R158.1 U18.6(VIN)
NetR155_2: R155.2 R159.1 U19.6(VIN)
NetR156_2: R156.2 R162.1 U18.4(PEGS)
NetR157_2: R157.2 R163.1 U19.4(PEGS)
NetR160_2: R160.2 R166.1 U20.2(-INA)
NetR161_2: R161.2 R167.1 U20.13(-IND)

Not connected (* = marked no-connect by the designer): U7 8(~{EF}); U8 8(~{EF}); U11 8(~{EF}); U12 8(~{EF}); U14 8(~{EF}); U15 8(~{EF}); U18 8(~{EF}); U19 8(~{EF})

### Notes on the sheet
- V/I CH1
- V/I CH2
- V/I CH4
- DAC CH1-CH4
- V/I CH3
- V/I CH5
- V/I CH6
- V/I CH7
- V/I CH8
- DAC CH5-CH8

### Library data of the parts
C21-C62 = Cap: as C66 on sheet MainPower; Published: 08/06/2000; Publisher: Altium Hobart Technology Centre; SubClass: Capacitor
D14-D21 = D Schottky: Schottky Diode; Published: 8-Jun-2000; LatestRevisionDate: 17-Jul-2002; LatestRevisionNote: Re-released for DXP Platform.; PackageReference: SMB; Publisher: Altium Limited; Code_JEDEC: DO-214-AA
Q1 Q2 Q5 Q6 Q9 Q10 Q13 Q14 = 2N3906: PNP General Purpose Amplifier; Published: 8-Jun-2000; LatestRevisionDate: 15-Jan-2003; LatestRevisionNote: PCB Footprint 'BCY-W3/D4.7' replaced; DatasheetVersion: 1997; PackageVersion: Sep-1998; PackageReference: TO-92A; Publisher: Altium Limited; PackageDescription: TO, Flat Index; 3 In-Line, Axial Leads; Body Dia. 4.5mm; Leads 0.51 x 0.48 mm (max); ComponentLink1Description: Manufacturer Link; ComponentLink1URL: http://www.fairchildsemi.com/; ComponentLink2Description: Datasheet; ComponentLink2URL: http://www.fairchildsemi.com/ds/2N%2F2N3906.pdf
Q3 Q4 Q7 Q8 Q11 Q12 Q15 Q16 = MOSFET-P: P-Channel MOSFET; Published: 8-Jun-2000; LatestRevisionDate: 17-Jul-2002; LatestRevisionNote: Re-released for DXP Platform.; PackageVersion: 1995/1996; PackageReference: E3; Publisher: Altium Limited; PackageDescription: TO, Flat Index; 3 In-Line, Axial Leads; Body Dia. 4.6mm; Lead Dia. 0.5 mm (max)
R80-R85 R89-R92 R97 R98 R100-R133 R137 R138 R140 R141 R146-R167 = RES
R86-R88 R93-R96 R99 R134-R136 R139 R142-R145 = Res Semi: Semiconductor Resistor; Published: 8-Jun-2000; LatestRevisionDate: 17-Jul-2002; LatestRevisionNote: Re-released for DXP Platform.; PackageReference: AXIAL-0.5; Publisher: Altium Limited
U7 U8 U11 U12 U14 U15 U18 U19 = XT
U9 U16 = DAC8554
U10 U13 U17 U20 = TLV41

## Sheet MainADC.SchDoc
size A4
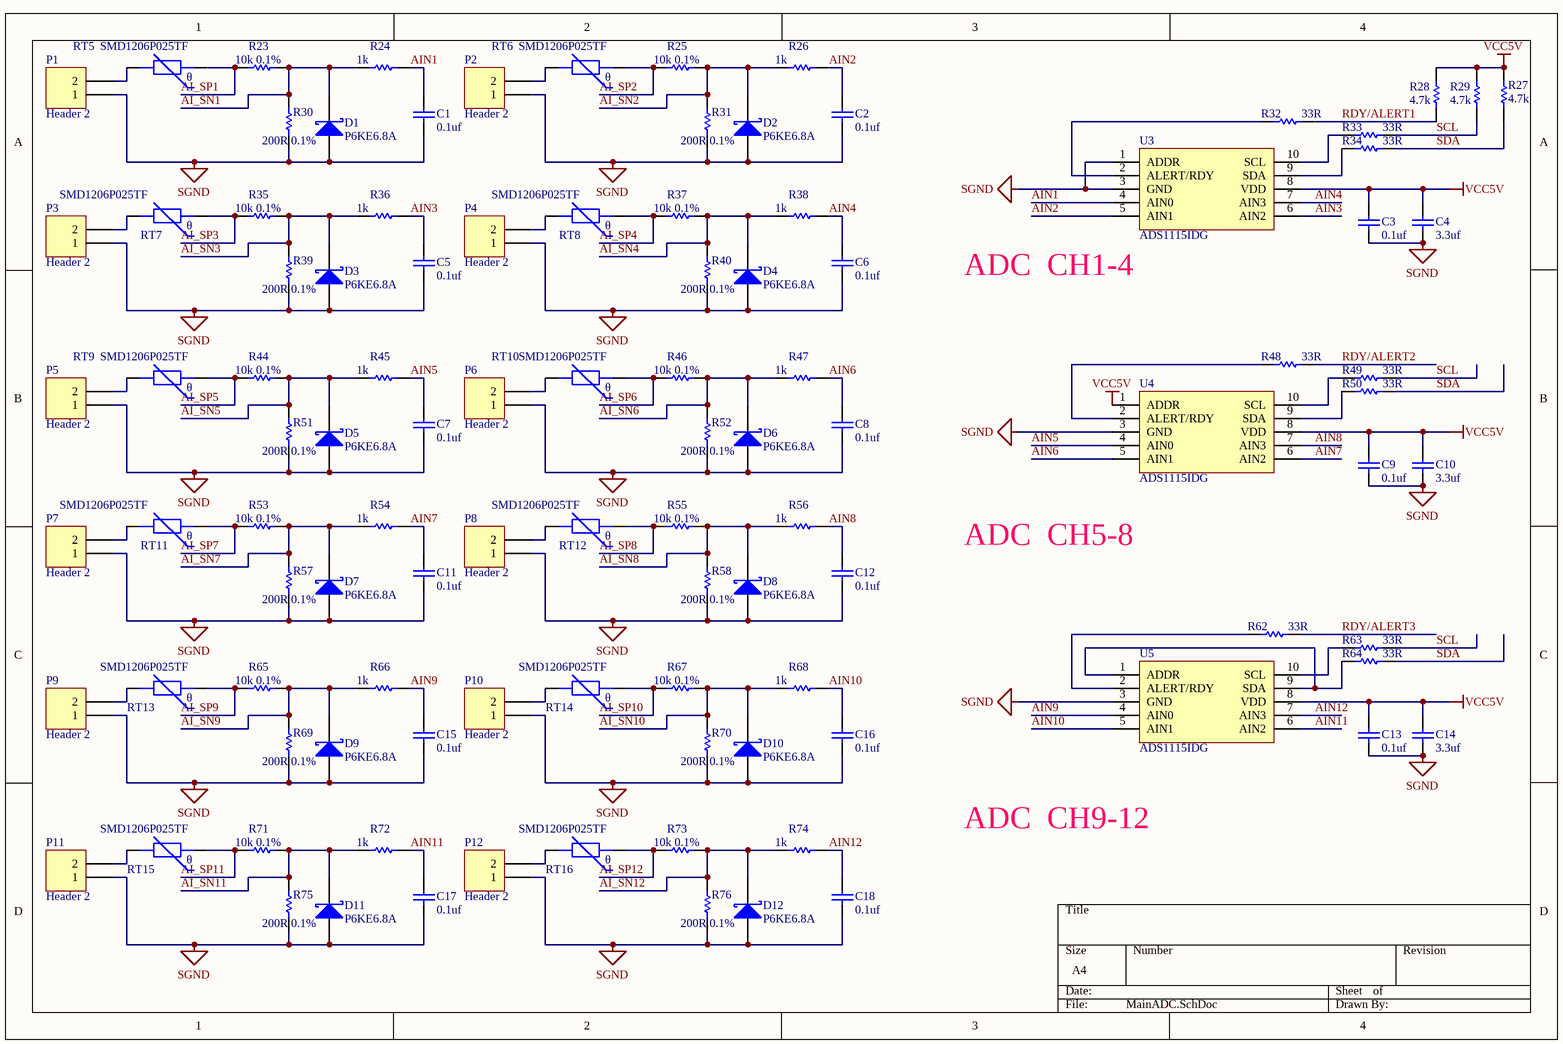
[diagram p4: MainADC.SchDoc]

### Parts
C1  value 0.1uf  [C0805]  (hidden comment: Cap)
C2  value 0.1uf  [C0805]  (hidden comment: Cap)
C3  value 0.1uf  [C0805]  (hidden comment: Cap)
C4  value 3.3uf  [C0805]  (hidden comment: Cap)
C5  value 0.1uf  [C0805]  (hidden comment: Cap)
C6  value 0.1uf  [C0805]  (hidden comment: Cap)
C7  value 0.1uf  [C0805]  (hidden comment: Cap)
C8  value 0.1uf  [C0805]  (hidden comment: Cap)
C9  value 0.1uf  [C0805]  (hidden comment: Cap)
C10  value 3.3uf  [C0805]  (hidden comment: Cap)
C11  value 0.1uf  [C0805]  (hidden comment: Cap)
C12  value 0.1uf  [C0805]  (hidden comment: Cap)
C13  value 0.1uf  [C0805]  (hidden comment: Cap)
C14  value 3.3uf  [C0805]  (hidden comment: Cap)
C15  value 0.1uf  [C0805]  (hidden comment: Cap)
C16  value 0.1uf  [C0805]  (hidden comment: Cap)
C17  value 0.1uf  [C0805]  (hidden comment: Cap)
C18  value 0.1uf  [C0805]  (hidden comment: Cap)
D1  P6KE6.8A  [SMB]
D2  P6KE6.8A  [SMB]
D3  P6KE6.8A  [SMB]
D4  P6KE6.8A  [SMB]
D5  P6KE6.8A  [SMB]
D6  P6KE6.8A  [SMB]
D7  P6KE6.8A  [SMB]
D8  P6KE6.8A  [SMB]
D9  P6KE6.8A  [SMB]
D10  P6KE6.8A  [SMB]
D11  P6KE6.8A  [SMB]
D12  P6KE6.8A  [SMB]
P1  Header 2  [JIEKE_2PX508]
P2  Header 2  [JIEKE_2PX508]
P3  Header 2  [JIEKE_2PX508]
P4  Header 2  [JIEKE_2PX508]
P5  Header 2  [JIEKE_2PX508]
P6  Header 2  [JIEKE_2PX508]
P7  Header 2  [JIEKE_2PX508]
P8  Header 2  [JIEKE_2PX508]
P9  Header 2  [JIEKE_2PX508]
P10  Header 2  [JIEKE_2PX508]
P11  Header 2  [JIEKE_2PX508]
P12  Header 2  [JIEKE_2PX508]
R23  value 10k 0.1%  [0805]  (hidden comment: Res Semi)
R24  value 1k  [0805]  (hidden comment: Res Semi)
R25  value 10k 0.1%  [0805]  (hidden comment: Res Semi)
R26  value 1k  [0805]  (hidden comment: Res Semi)
R27  value 4.7k  [0805]  (hidden comment: Res Semi)
R28  value 4.7k  [0805]  (hidden comment: Res Semi)
R29  value 4.7k  [0805]  (hidden comment: Res Semi)
R30  value 200R 0.1%  [0805]  (hidden comment: Res Semi)
R31  value 200R 0.1%  [0805]  (hidden comment: Res Semi)
R32  value 33R  [0805]  (hidden comment: Res Semi)
R33  value 33R  [0805]  (hidden comment: Res Semi)
R34  value 33R  [0805]  (hidden comment: Res Semi)
R35  value 10k 0.1%  [0805]  (hidden comment: Res Semi)
R36  value 1k  [0805]  (hidden comment: Res Semi)
R37  value 10k 0.1%  [0805]  (hidden comment: Res Semi)
R38  value 1k  [0805]  (hidden comment: Res Semi)
R39  value 200R 0.1%  [0805]  (hidden comment: Res Semi)
R40  value 200R 0.1%  [0805]  (hidden comment: Res Semi)
R44  value 10k 0.1%  [0805]  (hidden comment: Res Semi)
R45  value 1k  [0805]  (hidden comment: Res Semi)
R46  value 10k 0.1%  [0805]  (hidden comment: Res Semi)
R47  value 1k  [0805]  (hidden comment: Res Semi)
R48  value 33R  [0805]  (hidden comment: Res Semi)
R49  value 33R  [0805]  (hidden comment: Res Semi)
R50  value 33R  [0805]  (hidden comment: Res Semi)
R51  value 200R 0.1%  [0805]  (hidden comment: Res Semi)
R52  value 200R 0.1%  [0805]  (hidden comment: Res Semi)
R53  value 10k 0.1%  [0805]  (hidden comment: Res Semi)
R54  value 1k  [0805]  (hidden comment: Res Semi)
R55  value 10k 0.1%  [0805]  (hidden comment: Res Semi)
R56  value 1k  [0805]  (hidden comment: Res Semi)
R57  value 200R 0.1%  [0805]  (hidden comment: Res Semi)
R58  value 200R 0.1%  [0805]  (hidden comment: Res Semi)
R62  value 33R  [0805]  (hidden comment: Res Semi)
R63  value 33R  [0805]  (hidden comment: Res Semi)
R64  value 33R  [0805]  (hidden comment: Res Semi)
R65  value 10k 0.1%  [0805]  (hidden comment: Res Semi)
R66  value 1k  [0805]  (hidden comment: Res Semi)
R67  value 10k 0.1%  [0805]  (hidden comment: Res Semi)
R68  value 1k  [0805]  (hidden comment: Res Semi)
R69  value 200R 0.1%  [0805]  (hidden comment: Res Semi)
R70  value 200R 0.1%  [0805]  (hidden comment: Res Semi)
R71  value 10k 0.1%  [0805]  (hidden comment: Res Semi)
R72  value 1k  [0805]  (hidden comment: Res Semi)
R73  value 10k 0.1%  [0805]  (hidden comment: Res Semi)
R74  value 1k  [0805]  (hidden comment: Res Semi)
R75  value 200R 0.1%  [0805]  (hidden comment: Res Semi)
R76  value 200R 0.1%  [0805]  (hidden comment: Res Semi)
RT5  SMD1206P025TF  [1206]
RT6  SMD1206P025TF  [1206]
RT7  SMD1206P025TF  [1206]
RT8  SMD1206P025TF  [1206]
RT9  SMD1206P025TF  [1206]
RT10  SMD1206P025TF  [1206]
RT11  SMD1206P025TF  [1206]
RT12  SMD1206P025TF  [1206]
RT13  SMD1206P025TF  [1206]
RT14  SMD1206P025TF  [1206]
RT15  SMD1206P025TF  [1206]
RT16  SMD1206P025TF  [1206]
U3  ADS1115IDG  [10uSOP_M]
U4  ADS1115IDG  [10uSOP_M]
U5  ADS1115IDG  [10uSOP_M]

### Nets
SGND: C1.2 C2.2 C3.2 C4.2 C5.2 C6.2 C7.2 C8.2 C9.2 C10.2 C11.2 C12.2 C13.2 C14.2 C15.2 C16.2 C17.2 C18.2 D1.1(A) D2.1(A) D3.1(A) D4.1(A) D5.1(A) D6.1(A) D7.1(A) D8.1(A) D9.1(A) D10.1(A) D11.1(A) D12.1(A) P1.1 P2.1 P3.1 P4.1 P5.1 P6.1 P7.1 P8.1 P9.1 P10.1 P11.1 P12.1 R30.2 R31.2 R39.2 R40.2 R51.2 R52.2 R57.2 R58.2 R69.2 R70.2 R75.2 R76.2 U3.1(ADDR) U3.3(GND) U4.3(GND) U5.3(GND)
VCC5V: C3.1 C4.1 C9.1 C10.1 C13.1 C14.1 R27.1 R28.1 R29.1 U3.8(VDD) U4.1(ADDR) U4.8(VDD) U5.8(VDD)
AI_SN1: D1.2(K) R23.1 R24.2 R30.1
AI_SN2: D2.2(K) R25.1 R26.2 R31.1
AI_SN3: D3.2(K) R35.1 R36.2 R39.1
AI_SN4: D4.2(K) R37.1 R38.2 R40.1
AI_SN5: D5.2(K) R44.1 R45.2 R51.1
AI_SN6: D6.2(K) R46.1 R47.2 R52.1
AI_SN7: D7.2(K) R53.1 R54.2 R57.1
AI_SN8: D8.2(K) R55.1 R56.2 R58.1
AI_SN9: D9.2(K) R65.1 R66.2 R69.1
AI_SN10: D10.2(K) R67.1 R68.2 R70.1
AI_SN11: D11.2(K) R71.1 R72.2 R75.1
AI_SN12: D12.2(K) R73.1 R74.2 R76.1
AI_SP1: R23.2 RT5.2
AI_SP2: R25.2 RT6.2
AI_SP3: R35.2 RT7.2
AI_SP4: R37.2 RT8.2
AI_SP5: R44.2 RT9.2
AI_SP6: R46.2 RT10.2
AI_SP7: R53.2 RT11.2
AI_SP8: R55.2 RT12.2
AI_SP9: R65.2 RT13.2
AI_SP10: R67.2 RT14.2
AI_SP11: R71.2 RT15.2
AI_SP12: R73.2 RT16.2
AIN1: C1.1 R24.1 U3.4(AIN0)
AIN2: C2.1 R26.1 U3.5(AIN1)
AIN3: C5.1 R36.1 U3.6(AIN2)
AIN4: C6.1 R38.1 U3.7(AIN3)
AIN5: C7.1 R45.1 U4.4(AIN0)
AIN6: C8.1 R47.1 U4.5(AIN1)
AIN7: C11.1 R54.1 U4.6(AIN2)
AIN8: C12.1 R56.1 U4.7(AIN3)
AIN9: C15.1 R66.1 U5.4(AIN0)
AIN10: C16.1 R68.1 U5.5(AIN1)
AIN11: C17.1 R72.1 U5.6(AIN2)
AIN12: C18.1 R74.1 U5.7(AIN3)
RDY/ALERT1: R28.2 R32.1
RDY/ALERT2: R48.1
RDY/ALERT3: R62.1
SCL: R29.2 R33.1 R49.1 R63.1
SDA: R27.2 R34.1 R50.1 R64.1
NetP1_2: P1.2 RT5.1
NetP2_2: P2.2 RT6.1
NetP3_2: P3.2 RT7.1
NetP4_2: P4.2 RT8.1
NetP5_2: P5.2 RT9.1
NetP6_2: P6.2 RT10.1
NetP7_2: P7.2 RT11.1
NetP8_2: P8.2 RT12.1
NetP9_2: P9.2 RT13.1
NetP10_2: P10.2 RT14.1
NetP11_2: P11.2 RT15.1
NetP12_2: P12.2 RT16.1
NetR32_2: R32.2 U3.2(ALERT/RDY)
NetR33_2: R33.2 U3.10(SCL)
NetR34_2: R34.2 U3.9(SDA)
NetR48_2: R48.2 U4.2(ALERT/RDY)
NetR49_2: R49.2 U4.10(SCL)
NetR50_2: R50.2 U4.9(SDA)
NetR62_2: R62.2 U5.2(ALERT/RDY)
NetR63_2: R63.2 U5.10(SCL)
NetR64_2: R64.2 U5.1(ADDR) U5.9(SDA)

### Notes on the sheet
- (near U3) ADC  CH1-4
- ADC  CH5-8
- ADC  CH9-12
- (in symbol PTC) θ

### Library data of the parts
C1-C18 = Cap: as C66 on sheet MainPower; Published: 08/06/2000; Publisher: Altium Hobart Technology Centre; SubClass: Capacitor
D1-D12 = D Schottky: Schottky Diode; Published: 8-Jun-2000; LatestRevisionDate: 17-Jul-2002; LatestRevisionNote: Re-released for DXP Platform.; PackageReference: SMB; Publisher: Altium Limited; Code_JEDEC: DO-214-AA
P1-P12 = Header 2: Header, 2-Pin; LatestRevisionDate: 17-Jul-2002; LatestRevisionNote: Re-released for DXP Platform.; Publisher: Altium Limited
R23-R40 R44-R58 R62-R76 = Res Semi: Semiconductor Resistor; Published: 8-Jun-2000; LatestRevisionDate: 17-Jul-2002; LatestRevisionNote: Re-released for DXP Platform.; PackageReference: AXIAL-0.5; Publisher: Altium Limited
RT5-RT16 = PTC: 热敏电阻
U3-U5 = ADS

## Sheet MainMux.SchDoc
size A4
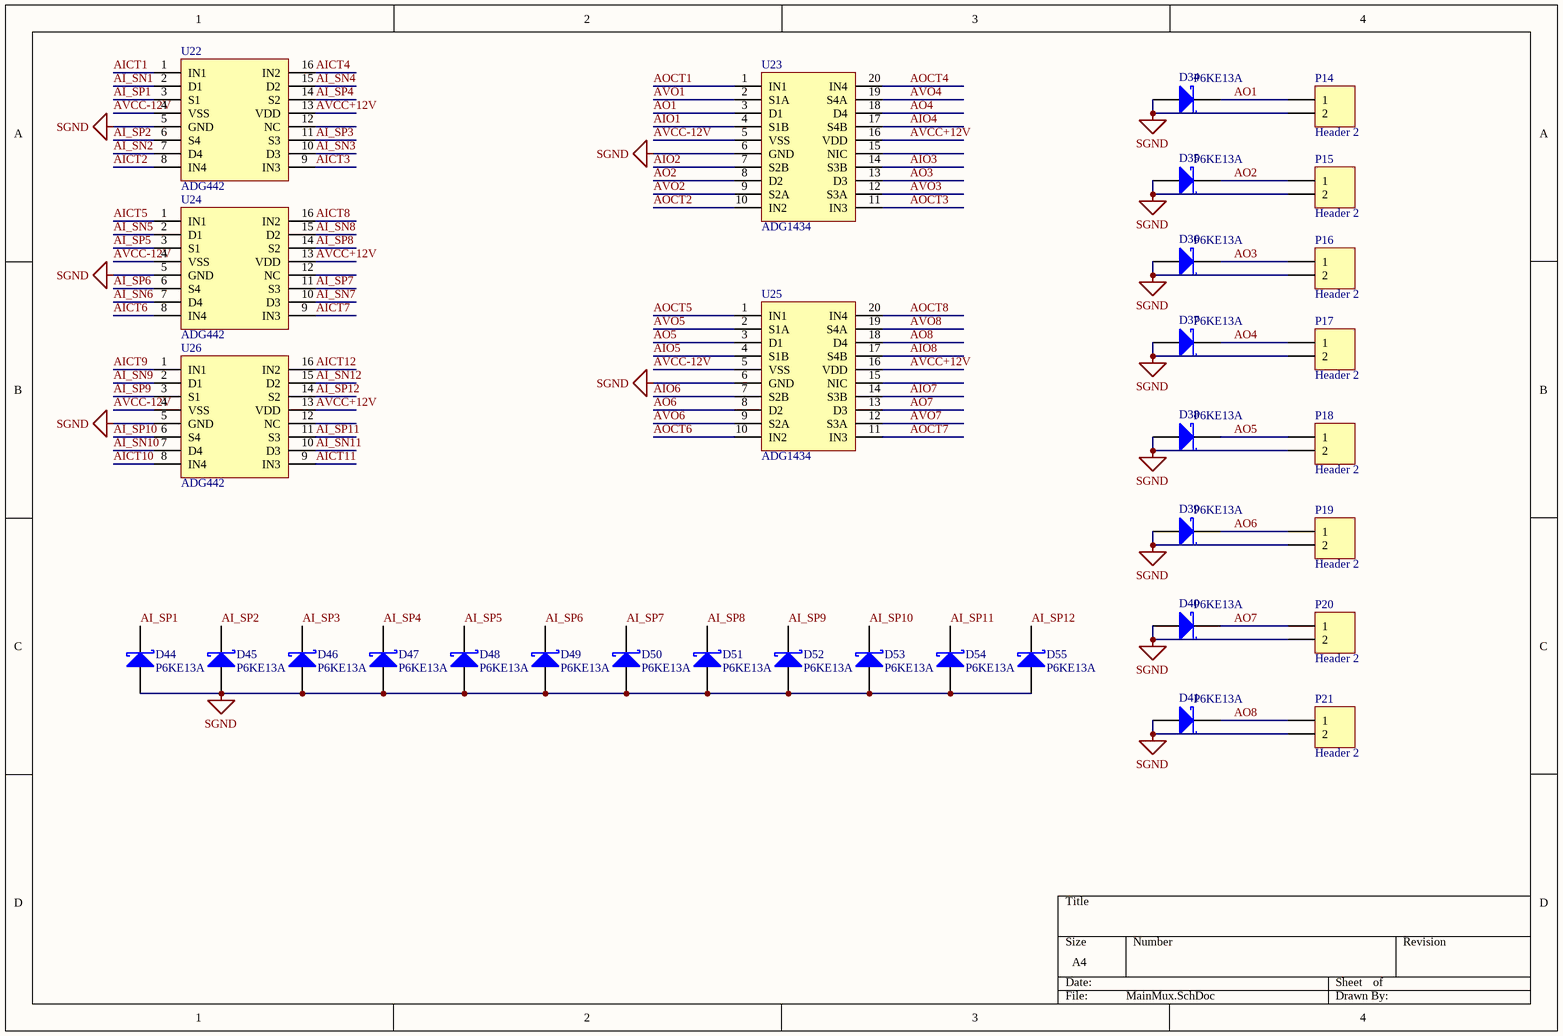
[diagram p5: MainMux.SchDoc]

### Parts
D34  P6KE13A  [SMB]
D35  P6KE13A  [SMB]
D36  P6KE13A  [SMB]
D37  P6KE13A  [SMB]
D38  P6KE13A  [SMB]
D39  P6KE13A  [SMB]
D40  P6KE13A  [SMB]
D41  P6KE13A  [SMB]
D44  P6KE13A  [SMB]
D45  P6KE13A  [SMB]
D46  P6KE13A  [SMB]
D47  P6KE13A  [SMB]
D48  P6KE13A  [SMB]
D49  P6KE13A  [SMB]
D50  P6KE13A  [SMB]
D51  P6KE13A  [SMB]
D52  P6KE13A  [SMB]
D53  P6KE13A  [SMB]
D54  P6KE13A  [SMB]
D55  P6KE13A  [SMB]
P14  Header 2  [JIEKE_2PX508]
P15  Header 2  [JIEKE_2PX508]
P16  Header 2  [JIEKE_2PX508]
P17  Header 2  [JIEKE_2PX508]
P18  Header 2  [JIEKE_2PX508]
P19  Header 2  [JIEKE_2PX508]
P20  Header 2  [JIEKE_2PX508]
P21  Header 2  [JIEKE_2PX508]
U22  ADG442  [SOIC127P600-16M]
U23  ADG1434  [TSSOP20]
U24  ADG442  [SOIC127P600-16M]
U25  ADG1434  [TSSOP20]
U26  ADG442  [SOIC127P600-16M]

### Nets
SGND: D34.1(A) D35.1(A) D36.1(A) D37.1(A) D38.1(A) D39.1(A) D40.1(A) D41.1(A) D44.1(A) D45.1(A) D46.1(A) D47.1(A) D48.1(A) D49.1(A) D50.1(A) D51.1(A) D52.1(A) D53.1(A) D54.1(A) D55.1(A) P14.2 P15.2 P16.2 P17.2 P18.2 P19.2 P20.2 P21.2 U22.5(GND) U23.6(GND) U24.5(GND) U25.6(GND) U26.5(GND)
AI_SN1: U22.2(D1)
AI_SN2: U22.7(D4)
AI_SN3: U22.10(D3)
AI_SN4: U22.15(D2)
AI_SN5: U24.2(D1)
AI_SN6: U24.7(D4)
AI_SN7: U24.10(D3)
AI_SN8: U24.15(D2)
AI_SN9: U26.2(D1)
AI_SN10: U26.7(D4)
AI_SN11: U26.10(D3)
AI_SN12: U26.15(D2)
AI_SP1: D44.2(K) U22.3(S1)
AI_SP2: D45.2(K) U22.6(S4)
AI_SP3: D46.2(K) U22.11(S3)
AI_SP4: D47.2(K) U22.14(S2)
AI_SP5: D48.2(K) U24.3(S1)
AI_SP6: D49.2(K) U24.6(S4)
AI_SP7: D50.2(K) U24.11(S3)
AI_SP8: D51.2(K) U24.14(S2)
AI_SP9: D52.2(K) U26.3(S1)
AI_SP10: D53.2(K) U26.6(S4)
AI_SP11: D54.2(K) U26.11(S3)
AI_SP12: D55.2(K) U26.14(S2)
AICT1: U22.1(IN1)
AICT2: U22.8(IN4)
AICT3: U22.9(IN3)
AICT4: U22.16(IN2)
AICT5: U24.1(IN1)
AICT6: U24.8(IN4)
AICT7: U24.9(IN3)
AICT8: U24.16(IN2)
AICT9: U26.1(IN1)
AICT10: U26.8(IN4)
AICT11: U26.9(IN3)
AICT12: U26.16(IN2)
AIO1: U23.4(S1B)
AIO2: U23.7(S2B)
AIO3: U23.14(S3B)
AIO4: U23.17(S4B)
AIO5: U25.4(S1B)
AIO6: U25.7(S2B)
AIO7: U25.14(S3B)
AIO8: U25.17(S4B)
AO1: D34.2(K) P14.1 U23.3(D1)
AO2: D35.2(K) P15.1 U23.8(D2)
AO3: D36.2(K) P16.1 U23.13(D3)
AO4: D37.2(K) P17.1 U23.18(D4)
AO5: D38.2(K) P18.1 U25.3(D1)
AO6: D39.2(K) P19.1 U25.8(D2)
AO7: D40.2(K) P20.1 U25.13(D3)
AO8: D41.2(K) P21.1 U25.18(D4)
AOCT1: U23.1(IN1)
AOCT2: U23.10(IN2)
AOCT3: U23.11(IN3)
AOCT4: U23.20(IN4)
AOCT5: U25.1(IN1)
AOCT6: U25.10(IN2)
AOCT7: U25.11(IN3)
AOCT8: U25.20(IN4)
AVCC+12V: U22.13(VDD) U23.16(VDD) U24.13(VDD) U25.16(VDD) U26.13(VDD)
AVCC-12V: U22.4(VSS) U23.5(VSS) U24.4(VSS) U25.5(VSS) U26.4(VSS)
AVO1: U23.2(S1A)
AVO2: U23.9(S2A)
AVO3: U23.12(S3A)
AVO4: U23.19(S4A)
AVO5: U25.2(S1A)
AVO6: U25.9(S2A)
AVO7: U25.12(S3A)
AVO8: U25.19(S4A)

Not connected (* = marked no-connect by the designer): U22 12(NC); U23 15(NIC); U24 12(NC); U25 15(NIC); U26 12(NC)

### Library data of the parts
D34-D41 D44-D55 = D Schottky: Schottky Diode; Published: 8-Jun-2000; LatestRevisionDate: 17-Jul-2002; LatestRevisionNote: Re-released for DXP Platform.; PackageReference: SMB; Publisher: Altium Limited; Code_JEDEC: DO-214-AA
P14-P21 = Header 2: Header, 2-Pin; LatestRevisionDate: 17-Jul-2002; LatestRevisionNote: Re-released for DXP Platform.; Publisher: Altium Limited
U22 U24 U26 = ADG441-AD
U23 U25 = ADG

## Sheet MainRTD.SchDoc
size A4
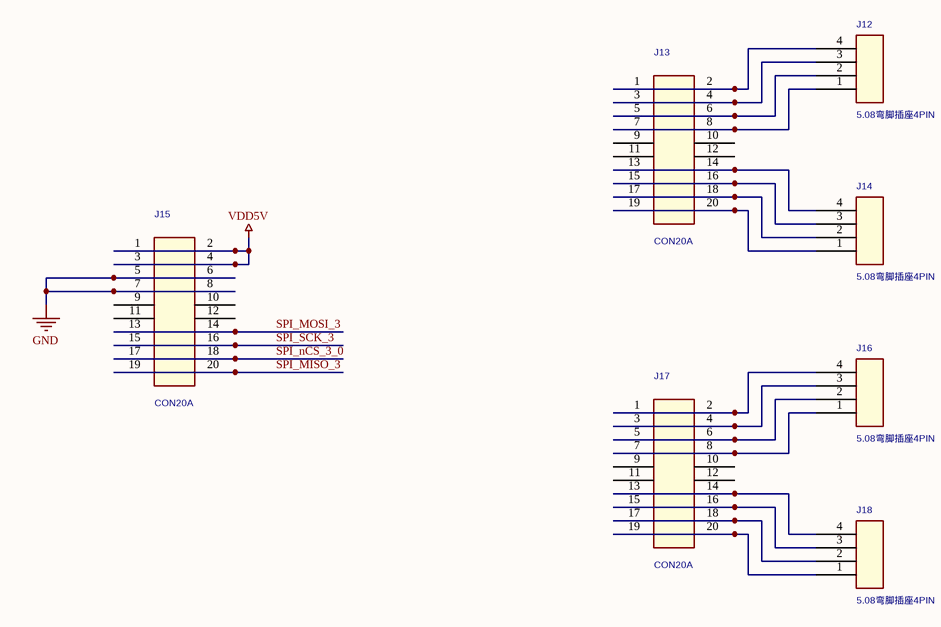
[diagram p6: MainRTD.SchDoc]

### Parts
J12  5.08弯脚插座4PIN  [JIEKE_4PX508]
J13  CON20A  [HDR2X10]
J14  5.08弯脚插座4PIN  [JIEKE_4PX508]
J15  CON20A  [HDR2X10]
J16  5.08弯脚插座4PIN  [JIEKE_4PX508]
J17  CON20A  [HDR2X10]
J18  5.08弯脚插座4PIN  [JIEKE_4PX508]

### Nets
GND: J15.5 J15.6 J15.7 J15.8
VDD5V: J15.1 J15.2 J15.3 J15.4
SPI_MISO_3: J15.19 J15.20
SPI_MOSI_3: J15.13 J15.14
SPI_nCS_3_0: J15.17 J15.18
SPI_SCK_3: J15.15 J15.16
NetJ12_1: J12.1 J13.7 J13.8
NetJ12_2: J12.2 J13.5 J13.6
NetJ12_3: J12.3 J13.3 J13.4
NetJ12_4: J12.4 J13.1 J13.2
NetJ13_13: J13.13 J13.14 J14.4
NetJ13_15: J13.15 J13.16 J14.3
NetJ13_17: J13.17 J13.18 J14.2
NetJ13_19: J13.19 J13.20 J14.1
NetJ16_1: J16.1 J17.7 J17.8
NetJ16_2: J16.2 J17.5 J17.6
NetJ16_3: J16.3 J17.3 J17.4
NetJ16_4: J16.4 J17.1 J17.2
NetJ17_13: J17.13 J17.14 J18.4
NetJ17_15: J17.15 J17.16 J18.3
NetJ17_17: J17.17 J17.18 J18.2
NetJ17_19: J17.19 J17.20 J18.1

Not connected (* = marked no-connect by the designer): J13 9 10 11 12; J15 9 10 11 12; J17 9 10 11 12

### Library data of the parts
J12 J14 J16 J18 = CON4: PCB Footprint SMD: 插件
  J12: TOLERANCE: =J68_TOLERANCE
  J14: TOLERANCE: =J69_TOLERANCE
  J16: TOLERANCE: =J72_TOLERANCE
  J18: TOLERANCE: =J73_TOLERANCE
J13 J15 J17 = CON20A: PCB Footprint SMD: 插件
  J13: TOLERANCE: =J67_TOLERANCE
  J15: TOLERANCE: =J70_TOLERANCE
  J17: TOLERANCE: =J71_TOLERANCE

## Sheet Main485.SchDoc
size A4
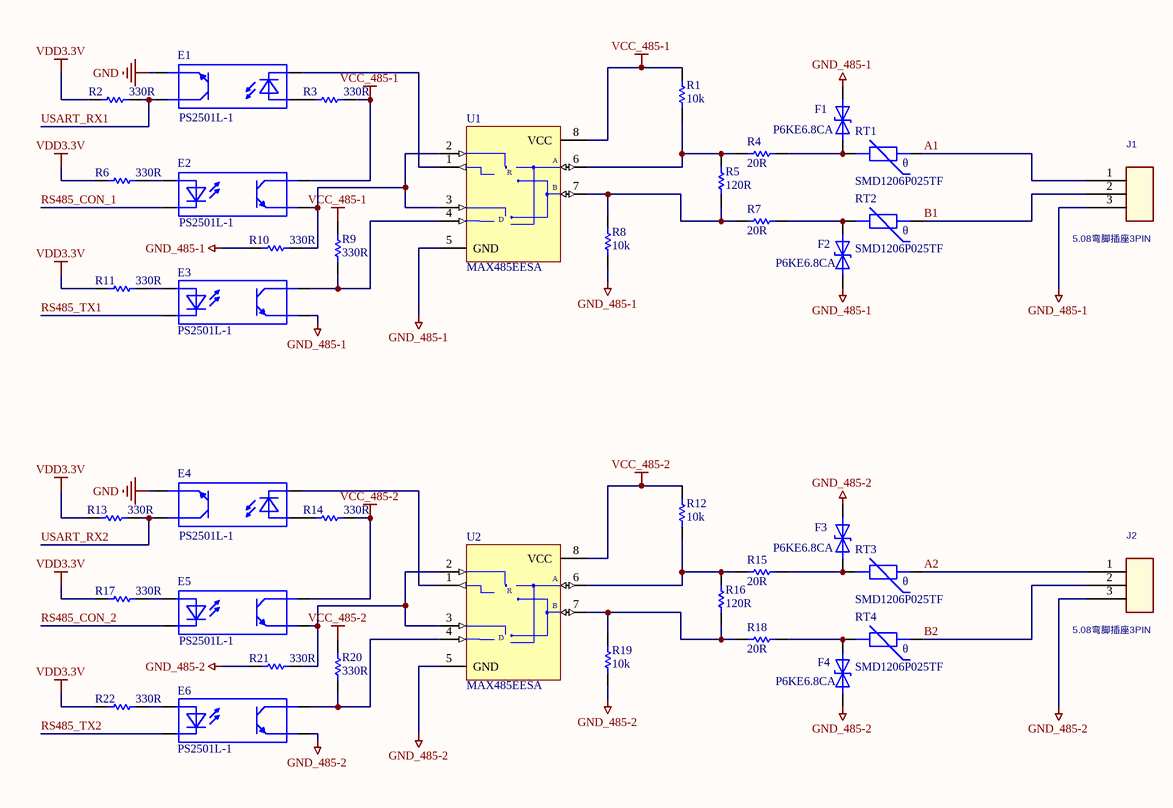
[diagram p7: Main485.SchDoc]

### Parts
E1  PS2501L-1  [NEC2501]
E2  PS2501L-1  [NEC2501]
E3  PS2501L-1  [NEC2501]
E4  PS2501L-1  [NEC2501]
E5  PS2501L-1  [NEC2501]
E6  PS2501L-1  [NEC2501]
F1  P6KE6.8CA  [P6KE6,8CA]
F2  P6KE6.8CA  [P6KE6,8CA]
F3  P6KE6.8CA  [P6KE6,8CA]
F4  P6KE6.8CA  [P6KE6,8CA]
J1  5.08弯脚插座3PIN  [JIEKE_3PX508]
J2  5.08弯脚插座3PIN  [JIEKE_3PX508]
R1  value 10k  [0805]  (hidden comment: Res Semi)
R2  value 330R  [0805]  (hidden comment: Res Semi)
R3  value 330R  [0805]  (hidden comment: Res Semi)
R4  value 20R  [0805]  (hidden comment: Res Semi)
R5  value 120R  [0805]  (hidden comment: Res Semi)
R6  value 330R  [0805]  (hidden comment: Res Semi)
R7  value 20R  [0805]  (hidden comment: Res Semi)
R8  value 10k  [0805]  (hidden comment: Res Semi)
R9  value 330R  [0805]  (hidden comment: Res Semi)
R10  value 330R  [0805]  (hidden comment: Res Semi)
R11  value 330R  [0805]  (hidden comment: Res Semi)
R12  value 10k  [0805]  (hidden comment: Res Semi)
R13  value 330R  [0805]  (hidden comment: Res Semi)
R14  value 330R  [0805]  (hidden comment: Res Semi)
R15  value 20R  [0805]  (hidden comment: Res Semi)
R16  value 120R  [0805]  (hidden comment: Res Semi)
R17  value 330R  [0805]  (hidden comment: Res Semi)
R18  value 20R  [0805]  (hidden comment: Res Semi)
R19  value 10k  [0805]  (hidden comment: Res Semi)
R20  value 330R  [0805]  (hidden comment: Res Semi)
R21  value 330R  [0805]  (hidden comment: Res Semi)
R22  value 330R  [0805]  (hidden comment: Res Semi)
RT1  SMD1206P025TF  [1206]
RT2  SMD1206P025TF  [1206]
RT3  SMD1206P025TF  [1206]
RT4  SMD1206P025TF  [1206]
U1  MAX485EESA  [NSO8]
U2  MAX485EESA  [NSO8]

### Nets
GND: E1.3 E4.3
GND_485-1: E3.3 F1.1 F2.2 J1.3 R8.2 R10.2 U1.5(GND)
GND_485-2: E6.3 F3.1 F4.2 J2.3 R19.2 R21.2 U2.5(GND)
VCC_485-1: E2.4 R1.1 R3.1 R9.1 U1.8(VCC)
VCC_485-2: E5.4 R12.1 R14.1 R20.1 U2.8(VCC)
VDD3.3V: R2.2 R6.2 R11.2 R13.2 R17.2 R22.2
A1: J1.1 RT1.2
A2: J2.1 RT3.2
B1: J1.2 RT2.2
B2: J2.2 RT4.2
RS485_CON_1: E2.2
RS485_CON_2: E5.2
RS485_TX1: E3.2
RS485_TX2: E6.2
USART_RX1: E1.4 R2.1
USART_RX2: E4.4 R13.1
NetE1_1: E1.1 R3.2
NetE1_2: E1.2 U1.1(RO)
NetE2_1: E2.1 R6.1
NetE2_3: E2.3 R10.1 U1.2(~{RE}) U1.3(DE)
NetE3_1: E3.1 R11.1
NetE3_4: E3.4 R9.2 U1.4(DI)
NetE4_1: E4.1 R14.2
NetE4_2: E4.2 U2.1(RO)
NetE5_1: E5.1 R17.1
NetE5_3: E5.3 R21.1 U2.2(~{RE}) U2.3(DE)
NetE6_1: E6.1 R22.1
NetE6_4: E6.4 R20.2 U2.4(DI)
NetF1_2: F1.2 R4.2 RT1.1
NetF2_1: F2.1 R7.2 RT2.1
NetF3_2: F3.2 R15.2 RT3.1
NetF4_1: F4.1 R18.2 RT4.1
NetR1_2: R1.2 R4.1 R5.1 U1.6(A)
NetR5_2: R5.2 R7.1 R8.1 U1.7(B)
NetR12_2: R12.2 R15.1 R16.1 U2.6(A)
NetR16_2: R16.2 R18.1 R19.1 U2.7(B)

### Notes on the sheet
- (in symbol MAX485ESA) R; D
- (in symbol PTC) θ

### Library data of the parts
E1-E6 = OPT: 光耦
F1-F4 = TVS: 快速瞬变二极管
J1 J2 = CON3: TOLERANCE: =J65_TOLERANCE
R1-R22 = Res Semi: Semiconductor Resistor; Published: 8-Jun-2000; LatestRevisionDate: 17-Jul-2002; LatestRevisionNote: Re-released for DXP Platform.; PackageReference: AXIAL-0.5; Publisher: Altium Limited
RT1-RT4 = PTC: 热敏电阻
U1 U2 = MAX485ESA: Low-Power, Slew-Rate-Limited RS-485/RS-422 Transceiver; Code - JEDEC: MS-012-AA; Code - IPC: SO8; Published: 16-Jan-2001; Revision: 17-Jul-2002: Re-released for DXP Platform.; Datasheet: Latest Revision: Feb-1996; Package Reference: NSO8; Publisher: Altium Limited

## Sheet MainDin.SchDoc
size A4
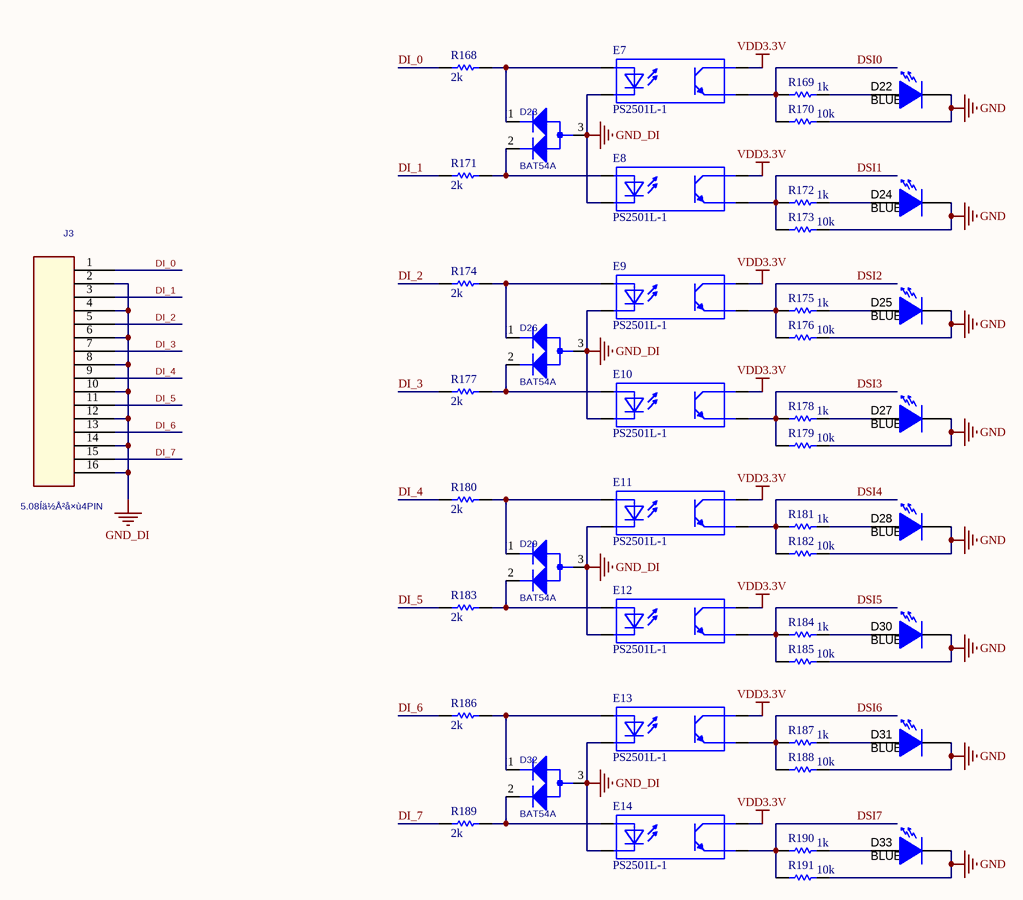
[diagram p8: MainDin.SchDoc]

### Parts
D22  value BLUE  [D0805]  (hidden comment: SML-P12YTT86)
D23  BAT54A  [SOT23]
D24  value BLUE  [D0805]  (hidden comment: SML-P12YTT86)
D25  value BLUE  [D0805]  (hidden comment: SML-P12YTT86)
D26  BAT54A  [SOT23]
D27  value BLUE  [D0805]  (hidden comment: SML-P12YTT86)
D28  value BLUE  [D0805]  (hidden comment: SML-P12YTT86)
D29  BAT54A  [SOT23]
D30  value BLUE  [D0805]  (hidden comment: SML-P12YTT86)
D31  value BLUE  [D0805]  (hidden comment: SML-P12YTT86)
D32  BAT54A  [SOT23]
D33  value BLUE  [D0805]  (hidden comment: SML-P12YTT86)
E7  PS2501L-1  [NEC2501]
E8  PS2501L-1  [NEC2501]
E9  PS2501L-1  [NEC2501]
E10  PS2501L-1  [NEC2501]
E11  PS2501L-1  [NEC2501]
E12  PS2501L-1  [NEC2501]
E13  PS2501L-1  [NEC2501]
E14  PS2501L-1  [NEC2501]
J3  5.08Íä½Å²å×ù4PIN  [JIEKE_16PX508]
R168  value 2k  [0805]  (hidden comment: Res Semi)
R169  value 1k  [0805]  (hidden comment: Res Semi)
R170  value 10k  [0805]  (hidden comment: Res Semi)
R171  value 2k  [0805]  (hidden comment: Res Semi)
R172  value 1k  [0805]  (hidden comment: Res Semi)
R173  value 10k  [0805]  (hidden comment: Res Semi)
R174  value 2k  [0805]  (hidden comment: Res Semi)
R175  value 1k  [0805]  (hidden comment: Res Semi)
R176  value 10k  [0805]  (hidden comment: Res Semi)
R177  value 2k  [0805]  (hidden comment: Res Semi)
R178  value 1k  [0805]  (hidden comment: Res Semi)
R179  value 10k  [0805]  (hidden comment: Res Semi)
R180  value 2k  [0805]  (hidden comment: Res Semi)
R181  value 1k  [0805]  (hidden comment: Res Semi)
R182  value 10k  [0805]  (hidden comment: Res Semi)
R183  value 2k  [0805]  (hidden comment: Res Semi)
R184  value 1k  [0805]  (hidden comment: Res Semi)
R185  value 10k  [0805]  (hidden comment: Res Semi)
R186  value 2k  [0805]  (hidden comment: Res Semi)
R187  value 1k  [0805]  (hidden comment: Res Semi)
R188  value 10k  [0805]  (hidden comment: Res Semi)
R189  value 2k  [0805]  (hidden comment: Res Semi)
R190  value 1k  [0805]  (hidden comment: Res Semi)
R191  value 10k  [0805]  (hidden comment: Res Semi)

### Nets
GND: D22.2(K) D24.2(K) D25.2(K) D27.2(K) D28.2(K) D30.2(K) D31.2(K) D33.2(K) R170.2 R173.2 R176.2 R179.2 R182.2 R185.2 R188.2 R191.2
GND_DI: D23.3 D26.3 D29.3 D32.3 E7.2 E8.2 E9.2 E10.2 E11.2 E12.2 E13.2 E14.2 J3.2 J3.4 J3.6 J3.8 J3.10 J3.12 J3.14 J3.16
VDD3.3V: E7.4 E8.4 E9.4 E10.4 E11.4 E12.4 E13.4 E14.4
DI_0: J3.1 R168.1
DI_1: J3.3 R171.1
DI_2: J3.5 R174.1
DI_3: J3.7 R177.1
DI_4: J3.9 R180.1
DI_5: J3.11 R183.1
DI_6: J3.13 R186.1
DI_7: J3.15 R189.1
DSI0: E7.3 R169.1 R170.1
DSI1: E8.3 R172.1 R173.1
DSI2: E9.3 R175.1 R176.1
DSI3: E10.3 R178.1 R179.1
DSI4: E11.3 R181.1 R182.1
DSI5: E12.3 R184.1 R185.1
DSI6: E13.3 R187.1 R188.1
DSI7: E14.3 R190.1 R191.1
NetD22_1: D22.1(A) R169.2
NetD23_1: D23.1 E7.1 R168.2
NetD23_2: D23.2 E8.1 R171.2
NetD24_1: D24.1(A) R172.2
NetD25_1: D25.1(A) R175.2
NetD26_1: D26.1 E9.1 R174.2
NetD26_2: D26.2 E10.1 R177.2
NetD27_1: D27.1(A) R178.2
NetD28_1: D28.1(A) R181.2
NetD29_1: D29.1 E11.1 R180.2
NetD29_2: D29.2 E12.1 R183.2
NetD30_1: D30.1(A) R184.2
NetD31_1: D31.1(A) R187.2
NetD32_1: D32.1 E13.1 R186.2
NetD32_2: D32.2 E14.1 R189.2
NetD33_1: D33.1(A) R190.2

### Library data of the parts
D22 D24 D25 D27 D28 D30 D31 D33 = SML-P12YTT86: as D13 on sheet MainCon; CompType: LED; PartNumber: SML-P12YTT86; SymbolVersion: 2008-12-08; MountType: SMT; RoHS: Y; PackageReference: Yellow LED; Published: 2008-07-11; Publisher: Texas Instruments; ComponentLink1URL: http://rohmfs.rohm.com/en/products/databook/datasheet/opto/led/chip_mono/sml-p1.pdf; ComponentLink1Description: Datasheet link; LatestRevisionDate: 2013-06-24; LatestRevisionNote: Updated supplier queries; Supplier 1: Digi-Key; Supplier Part Number 1: 511-1595-1-ND; Supplier 2: Mouser; Supplier Part Number 2: 755-SML-P12YTT86; Supplier 3: Farnell; Supplier Part Number 3: 1973107
D23 D26 D29 D32 = BAT54A/SOT_2: PCB Footprint SMD: SMD; SMT: Y; TOLERANCE: =D22_TOLERANCE
E7-E14 = OPTO: 光耦
J3 = CON16: PCB Footprint SMD: ²å¼þ; TOLERANCE: =J56_TOLERANCE
R168-R191 = Res Semi: Semiconductor Resistor; Published: 8-Jun-2000; LatestRevisionDate: 17-Jul-2002; LatestRevisionNote: Re-released for DXP Platform.; PackageReference: AXIAL-0.5; Publisher: Altium Limited

## Sheet MainDout.SchDoc
size A4
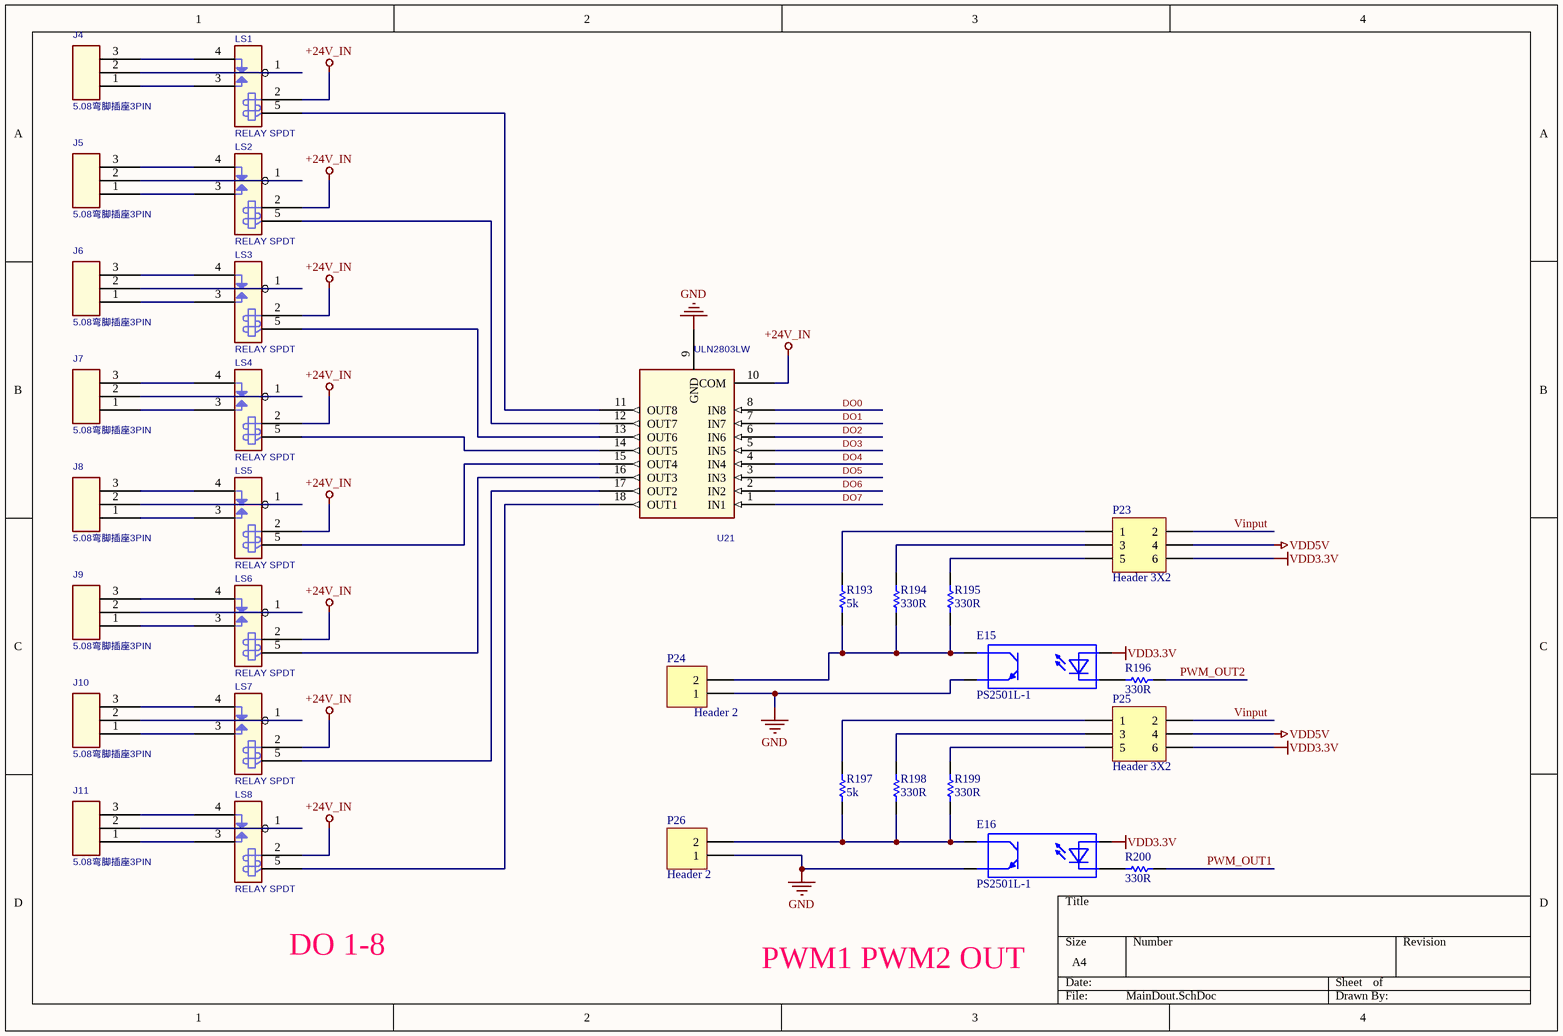
[diagram p9: MainDout.SchDoc]

### Parts
E15  PS2501L-1  [NEC2501]
E16  PS2501L-1  [NEC2501]
J4  5.08弯脚插座3PIN  [JIEKE_3PX508]
J5  5.08弯脚插座3PIN  [JIEKE_3PX508]
J6  5.08弯脚插座3PIN  [JIEKE_3PX508]
J7  5.08弯脚插座3PIN  [JIEKE_3PX508]
J8  5.08弯脚插座3PIN  [JIEKE_3PX508]
J9  5.08弯脚插座3PIN  [JIEKE_3PX508]
J10  5.08弯脚插座3PIN  [JIEKE_3PX508]
J11  5.08弯脚插座3PIN  [JIEKE_3PX508]
LS1  RELAY SPDT  [RELAY_OMRON_G5LE-14]
LS2  RELAY SPDT  [RELAY_OMRON_G5LE-14]
LS3  RELAY SPDT  [RELAY_OMRON_G5LE-14]
LS4  RELAY SPDT  [RELAY_OMRON_G5LE-14]
LS5  RELAY SPDT  [RELAY_OMRON_G5LE-14]
LS6  RELAY SPDT  [RELAY_OMRON_G5LE-14]
LS7  RELAY SPDT  [RELAY_OMRON_G5LE-14]
LS8  RELAY SPDT  [RELAY_OMRON_G5LE-14]
P23  Header 3X2  [HDR2X3]
P24  Header 2  [JIEKE_2PX508]
P25  Header 3X2  [HDR2X3]
P26  Header 2  [JIEKE_2PX508]
R193  value 5k  [0805]  (hidden comment: Res Semi)
R194  value 330R  [0805]  (hidden comment: Res Semi)
R195  value 330R  [0805]  (hidden comment: Res Semi)
R196  value 330R  [0805]  (hidden comment: Res Semi)
R197  value 5k  [0805]  (hidden comment: Res Semi)
R198  value 330R  [0805]  (hidden comment: Res Semi)
R199  value 330R  [0805]  (hidden comment: Res Semi)
R200  value 330R  [0805]  (hidden comment: Res Semi)
U21  ULN2803LW  [SO18WN]

### Nets
GND: E15.3 E16.3 P24.1 P26.1 U21.9(GND)
VDD3.3V: E15.1 E16.1 P23.6 P25.6
VDD5V: P23.4 P25.4
Vinput: LS1.2(COIL2) LS2.2(COIL2) LS3.2(COIL2) LS4.2(COIL2) LS5.2(COIL2) LS6.2(COIL2) LS7.2(COIL2) LS8.2(COIL2) P23.2 P25.2 U21.10(COM)  [also labelled +24V_IN]
DO0: U21.8(IN8)
DO1: U21.7(IN7)
DO2: U21.6(IN6)
DO3: U21.5(IN5)
DO4: U21.4(IN4)
DO5: U21.3(IN3)
DO6: U21.2(IN2)
DO7: U21.1(IN1)
PWM_OUT1: R200.2
PWM_OUT2: R196.2
NetE15_2: E15.2 R196.1
NetE15_4: E15.4 P24.2 R193.2 R194.2 R195.2
NetE16_2: E16.2 R200.1
NetE16_4: E16.4 P26.2 R197.2 R198.2 R199.2
NetJ4_1: J4.1 LS1.3(NO)
NetJ4_2: J4.2 LS1.1(COMMON)
NetJ4_3: J4.3 LS1.4(NC)
NetJ5_1: J5.1 LS2.3(NO)
NetJ5_2: J5.2 LS2.1(COMMON)
NetJ5_3: J5.3 LS2.4(NC)
NetJ6_1: J6.1 LS3.3(NO)
NetJ6_2: J6.2 LS3.1(COMMON)
NetJ6_3: J6.3 LS3.4(NC)
NetJ7_1: J7.1 LS4.3(NO)
NetJ7_2: J7.2 LS4.1(COMMON)
NetJ7_3: J7.3 LS4.4(NC)
NetJ8_1: J8.1 LS5.3(NO)
NetJ8_2: J8.2 LS5.1(COMMON)
NetJ8_3: J8.3 LS5.4(NC)
NetJ9_1: J9.1 LS6.3(NO)
NetJ9_2: J9.2 LS6.1(COMMON)
NetJ9_3: J9.3 LS6.4(NC)
NetJ10_1: J10.1 LS7.3(NO)
NetJ10_2: J10.2 LS7.1(COMMON)
NetJ10_3: J10.3 LS7.4(NC)
NetJ11_1: J11.1 LS8.3(NO)
NetJ11_2: J11.2 LS8.1(COMMON)
NetJ11_3: J11.3 LS8.4(NC)
NetLS1_5: LS1.5(COIL1) U21.11(OUT8)
NetLS2_5: LS2.5(COIL1) U21.12(OUT7)
NetLS3_5: LS3.5(COIL1) U21.13(OUT6)
NetLS4_5: LS4.5(COIL1) U21.14(OUT5)
NetLS5_5: LS5.5(COIL1) U21.15(OUT4)
NetLS6_5: LS6.5(COIL1) U21.16(OUT3)
NetLS7_5: LS7.5(COIL1) U21.17(OUT2)
NetLS8_5: LS8.5(COIL1) U21.18(OUT1)
NetP23_1: P23.1 R193.1
NetP23_3: P23.3 R194.1
NetP23_5: P23.5 R195.1
NetP25_1: P25.1 R197.1
NetP25_3: P25.3 R198.1
NetP25_5: P25.5 R199.1

### Notes on the sheet
- DO 1-8
- PWM1 PWM2 OUT

### Library data of the parts
E15 E16 = OPTO: 光耦
J4-J11 = CON3: PCB Footprint SMD: 插件; TOLERANCE: =J57_TOLERANCE
LS1-LS8 = RELAY SPDT_1
P23 P25 = Header 3X2: Header, 3-Pin, Dual row; LatestRevisionDate: 17-Jul-2002; LatestRevisionNote: Re-released for DXP Platform.; Publisher: Altium Limited
P24 P26 = Header 2: Header, 2-Pin; LatestRevisionDate: 17-Jul-2002; LatestRevisionNote: Re-released for DXP Platform.; Publisher: Altium Limited
R193-R200 = Res Semi: Semiconductor Resistor; Published: 8-Jun-2000; LatestRevisionDate: 17-Jul-2002; LatestRevisionNote: Re-released for DXP Platform.; PackageReference: AXIAL-0.5; Publisher: Altium Limited
U21 = ULN2803: PCB Footprint SMD: SMD; TOLERANCE: =U21_TOLERANCE